# EAGLE design adc-iq-2185-xp2 (EAGLE 5.11)

## Sheet 1 of 4
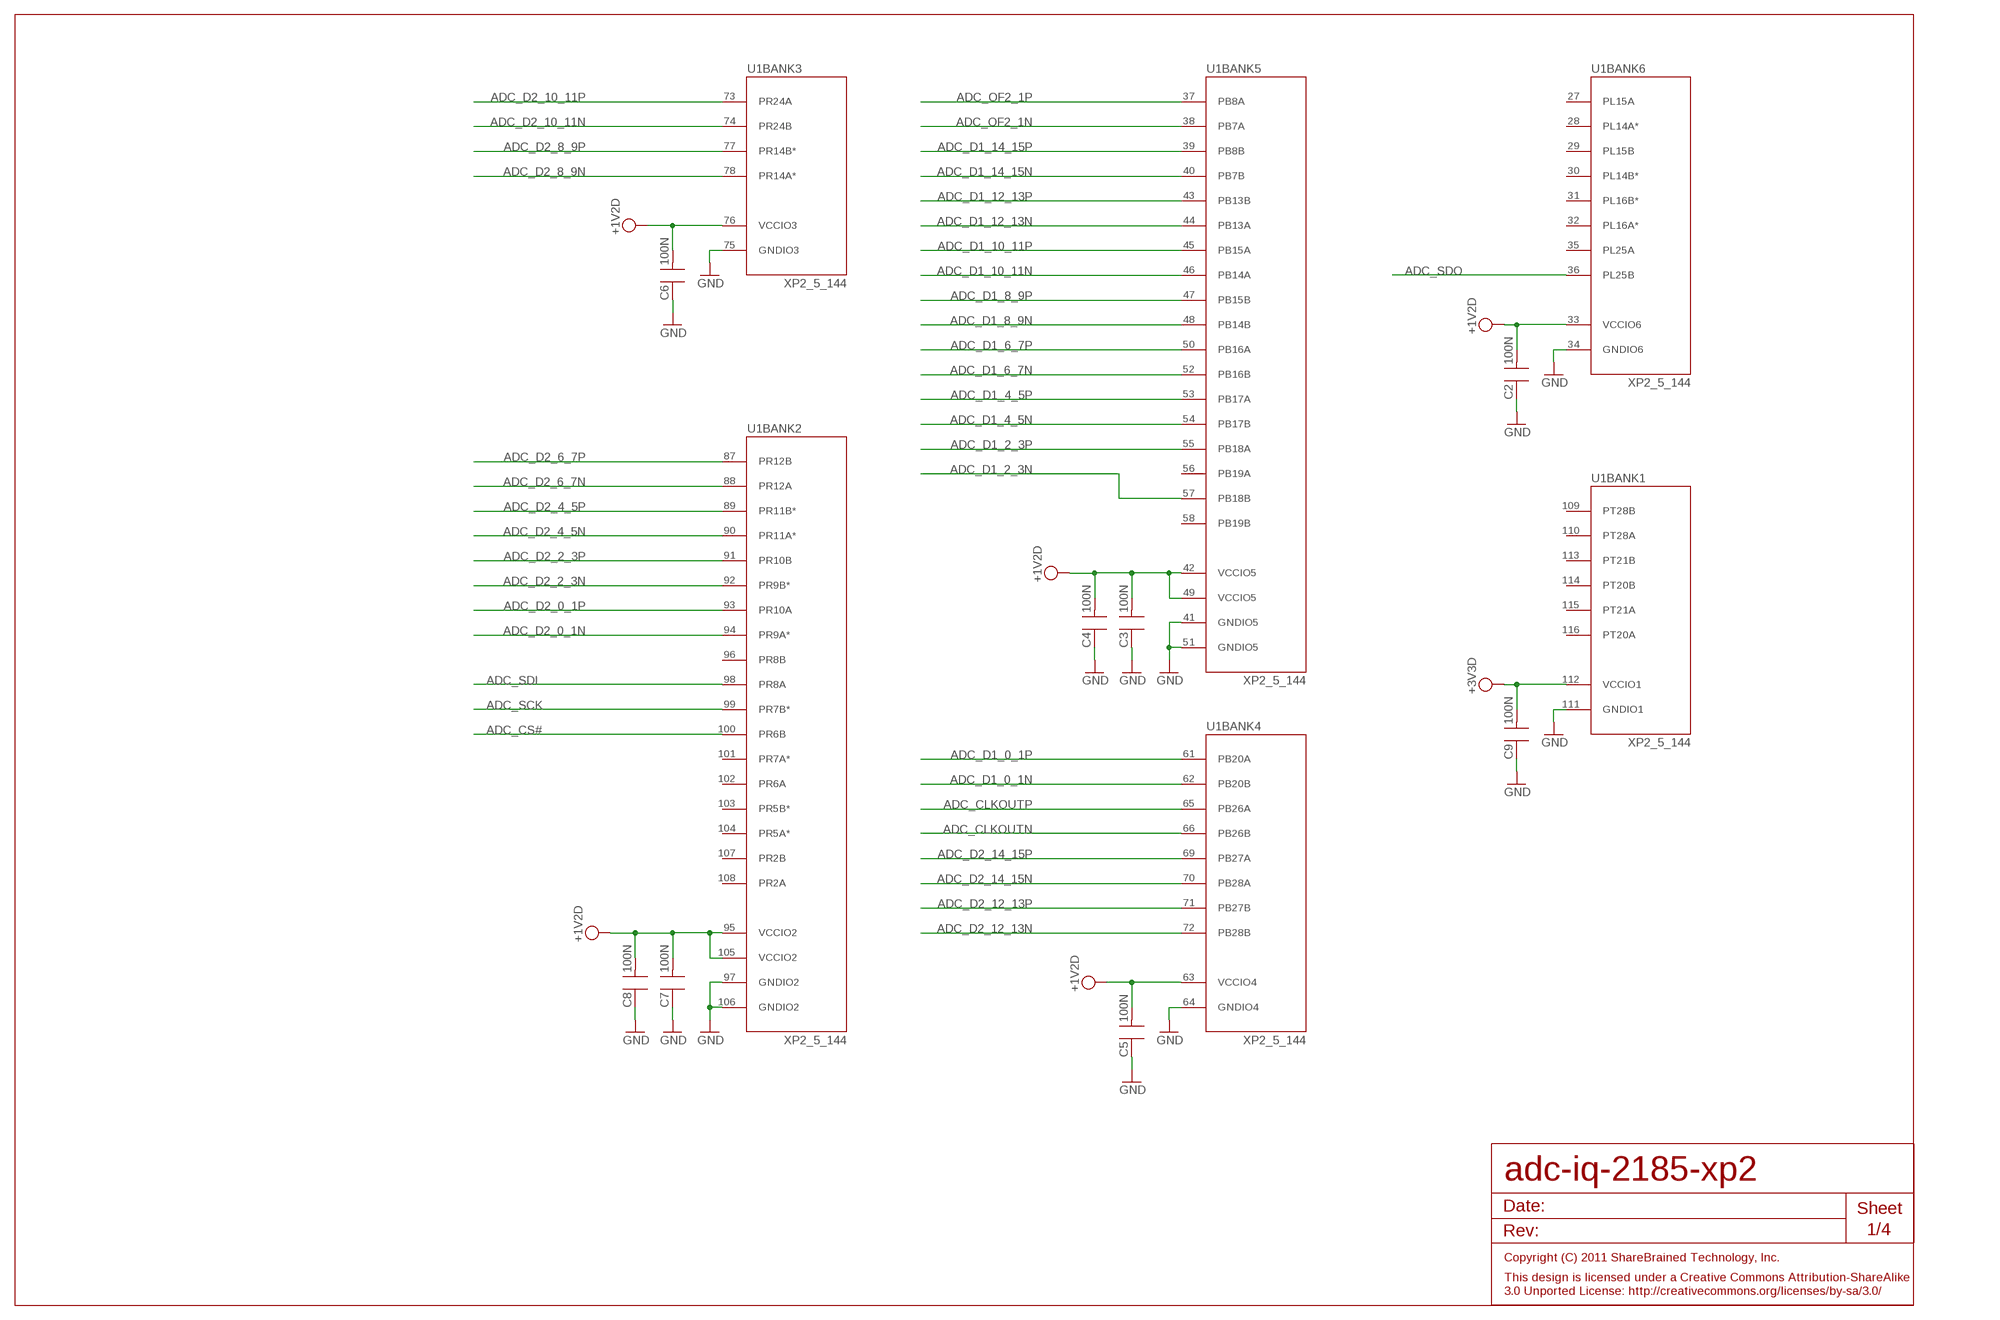
[diagram p0: schematic, sheet 1]

### Parts
C2  100N  C0402_55  [CAPC1005X55N]
C3  100N  C0402_55  [CAPC1005X55N]
C4  100N  C0402_55  [CAPC1005X55N]
C5  100N  C0402_55  [CAPC1005X55N]
C6  100N  C0402_55  [CAPC1005X55N]
C7  100N  C0402_55  [CAPC1005X55N]
C8  100N  C0402_55  [CAPC1005X55N]
C9  100N  C0402_55  [CAPC1005X55N]
U1  XP2_5_144  [QFP50P2200X2200X160-144N]

### Nets
+1V2D: C2.2 C3.2 C4.2 C5.2 C6.2 C7.2 C8.2 U1.33(BANK6:VCCIO6) U1.42(BANK5:VCCIO5) U1.49(BANK5:VCCIO5) U1.63(BANK4:VCCIO4) U1.76(BANK3:VCCIO3) U1.95(BANK2:VCCIO2) U1.105(BANK2:VCCIO2) ; also sheet 2,4
+3V3D: C9.2 U1.112(BANK1:VCCIO1) ; also sheet 2,3
ADC_CLKOUTN [lvds]: U1.66(BANK4:PB26B) ; also sheet 4
ADC_CLKOUTP [lvds]: U1.65(BANK4:PB26A) ; also sheet 4
ADC_CS#: U1.100(BANK2:PR6B) ; also sheet 4
ADC_D1_0_1N [lvds]: U1.62(BANK4:PB20B) ; also sheet 4
ADC_D1_0_1P [lvds]: U1.61(BANK4:PB20A) ; also sheet 4
ADC_D1_2_3N [lvds]: U1.57(BANK5:PB18B) ; also sheet 4
ADC_D1_2_3P [lvds]: U1.55(BANK5:PB18A) ; also sheet 4
ADC_D1_4_5N [lvds]: U1.54(BANK5:PB17B) ; also sheet 4
ADC_D1_4_5P [lvds]: U1.53(BANK5:PB17A) ; also sheet 4
ADC_D1_6_7N [lvds]: U1.52(BANK5:PB16B) ; also sheet 4
ADC_D1_6_7P [lvds]: U1.50(BANK5:PB16A) ; also sheet 4
ADC_D1_8_9N [lvds]: U1.48(BANK5:PB14B) ; also sheet 4
ADC_D1_8_9P [lvds]: U1.47(BANK5:PB15B) ; also sheet 4
ADC_D1_10_11N [lvds]: U1.46(BANK5:PB14A) ; also sheet 4
ADC_D1_10_11P [lvds]: U1.45(BANK5:PB15A) ; also sheet 4
ADC_D1_12_13N [lvds]: U1.44(BANK5:PB13A) ; also sheet 4
ADC_D1_12_13P [lvds]: U1.43(BANK5:PB13B) ; also sheet 4
ADC_D1_14_15N [lvds]: U1.40(BANK5:PB7B) ; also sheet 4
ADC_D1_14_15P [lvds]: U1.39(BANK5:PB8B) ; also sheet 4
ADC_D2_0_1N [lvds]: U1.94(BANK2:PR9A*) ; also sheet 4
ADC_D2_0_1P [lvds]: U1.93(BANK2:PR10A) ; also sheet 4
ADC_D2_2_3N [lvds]: U1.92(BANK2:PR9B*) ; also sheet 4
ADC_D2_2_3P [lvds]: U1.91(BANK2:PR10B) ; also sheet 4
ADC_D2_4_5N [lvds]: U1.90(BANK2:PR11A*) ; also sheet 4
ADC_D2_4_5P [lvds]: U1.89(BANK2:PR11B*) ; also sheet 4
ADC_D2_6_7N [lvds]: U1.88(BANK2:PR12A) ; also sheet 4
ADC_D2_6_7P [lvds]: U1.87(BANK2:PR12B) ; also sheet 4
ADC_D2_8_9N [lvds]: U1.78(BANK3:PR14A*) ; also sheet 4
ADC_D2_8_9P [lvds]: U1.77(BANK3:PR14B*) ; also sheet 4
ADC_D2_10_11N [lvds]: U1.74(BANK3:PR24B) ; also sheet 4
ADC_D2_10_11P [lvds]: U1.73(BANK3:PR24A) ; also sheet 4
ADC_D2_12_13N [lvds]: U1.72(BANK4:PB28B) ; also sheet 4
ADC_D2_12_13P [lvds]: U1.71(BANK4:PB27B) ; also sheet 4
ADC_D2_14_15N [lvds]: U1.70(BANK4:PB28A) ; also sheet 4
ADC_D2_14_15P [lvds]: U1.69(BANK4:PB27A) ; also sheet 4
ADC_OF2_1N [lvds]: U1.38(BANK5:PB7A) ; also sheet 4
ADC_OF2_1P [lvds]: U1.37(BANK5:PB8A) ; also sheet 4
ADC_SCK: U1.99(BANK2:PR7B*) ; also sheet 4
ADC_SDI: U1.98(BANK2:PR8A) ; also sheet 4
ADC_SDO: U1.36(BANK6:PL25B) ; also sheet 4
GND: C2.1 C3.1 C4.1 C5.1 C6.1 C7.1 C8.1 C9.1 U1.34(BANK6:GNDIO6) U1.41(BANK5:GNDIO5) U1.51(BANK5:GNDIO5) U1.64(BANK4:GNDIO4) U1.75(BANK3:GNDIO3) U1.97(BANK2:GNDIO2) U1.106(BANK2:GNDIO2) U1.111(BANK1:GNDIO1) ; also sheet 2,3,4
Unconnected: U1.27(BANK6:PL15A) U1.28(BANK6:PL14A*) U1.29(BANK6:PL15B) U1.30(BANK6:PL14B*) U1.31(BANK6:PL16B*) U1.32(BANK6:PL16A*) U1.35(BANK6:PL25A) U1.56(BANK5:PB19A) U1.58(BANK5:PB19B) U1.96(BANK2:PR8B) U1.101(BANK2:PR7A*) U1.102(BANK2:PR6A) U1.103(BANK2:PR5B*) U1.104(BANK2:PR5A*) U1.107(BANK2:PR2B) U1.108(BANK2:PR2A) U1.109(BANK1:PT28B) U1.110(BANK1:PT28A) U1.113(BANK1:PT21B) U1.114(BANK1:PT20B) U1.115(BANK1:PT21A) U1.116(BANK1:PT20A)

## Sheet 2 of 4
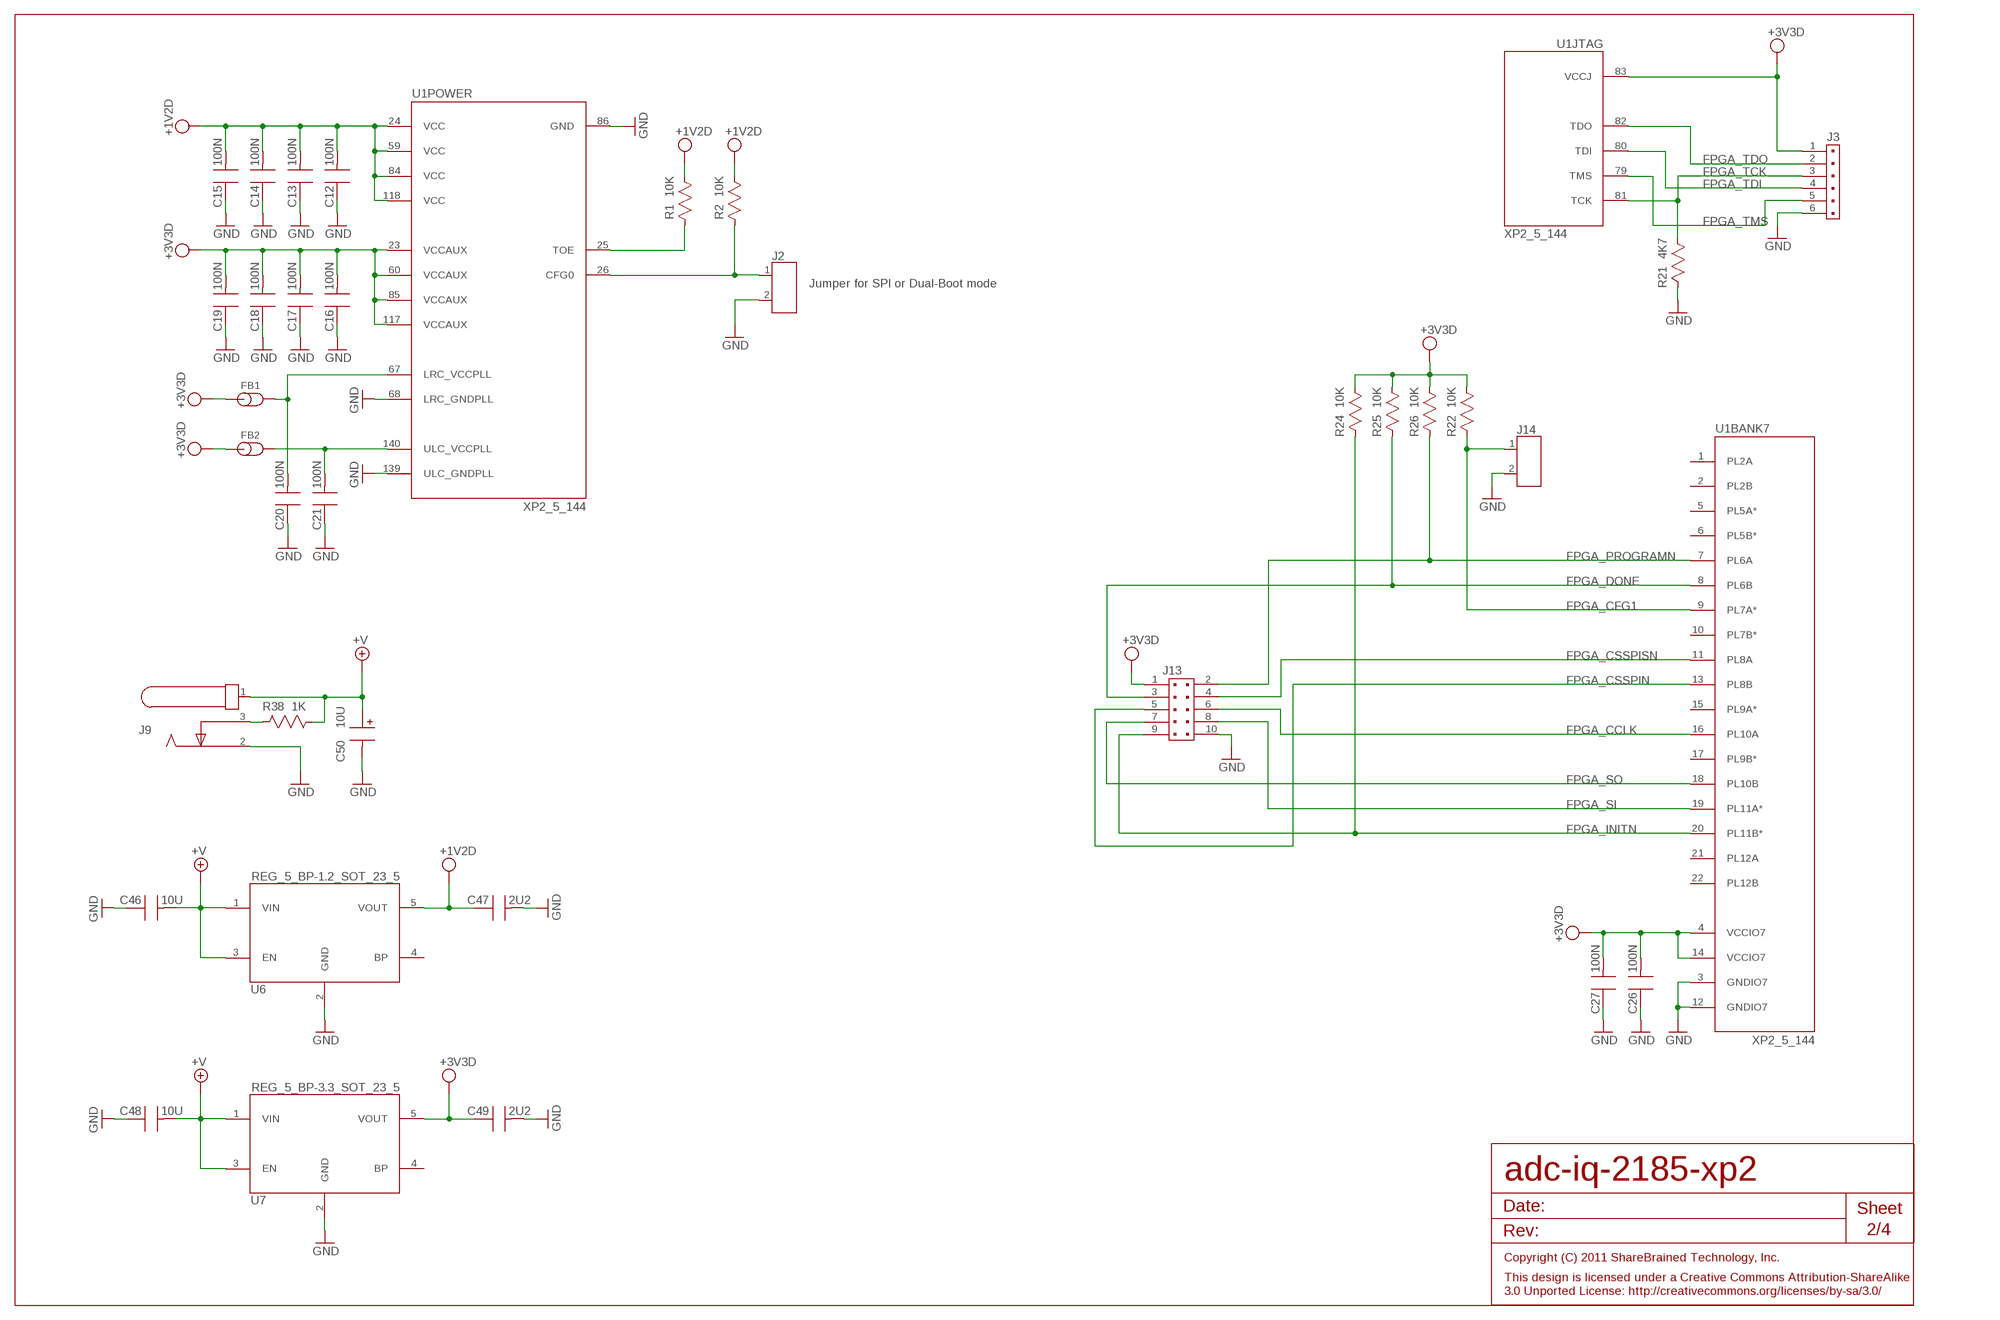
[diagram p1: schematic, sheet 2]

### Parts
C12  100N  C0402_55  [CAPC1005X55N]
C13  100N  C0402_55  [CAPC1005X55N]
C14  100N  C0402_55  [CAPC1005X55N]
C15  100N  C0402_55  [CAPC1005X55N]
C16  100N  C0402_55  [CAPC1005X55N]
C17  100N  C0402_55  [CAPC1005X55N]
C18  100N  C0402_55  [CAPC1005X55N]
C19  100N  C0402_55  [CAPC1005X55N]
C20  100N  C0402_55  [CAPC1005X55N]
C21  100N  C0402_55  [CAPC1005X55N]
C26  100N  C0402_55  [CAPC1005X55N]
C27  100N  C0402_55  [CAPC1005X55N]
C46  10U  C0805_135  [CAPC2012X135N]
C47  2U2  C0603_90  [CAPC1608X90N]
C48  10U  C0805_135  [CAPC2012X135N]
C49  2U2  C0603_90  [CAPC1608X90N]
C50  10U  CPOL7343-43  [CAPMP7343X430N]
FB1  FB0603  [INDC1608X95N]
FB2  FB0603  [INDC1608X95N]
J2  CON2TH-254  [HEADER254P1X2]
J3  HEADER1X6TH-254  [HEADER254P1X6]
J9  DC_3_CUI_PJ102A  [CUI_PJ_102A]
J13  HEADER2X5TH-254  [HEADER254P2X5]
J14  CON2TH-254  [HEADER254P1X2]
R1  10K  R0402_40  [RESC1005X40N]
R2  10K  R0402_40  [RESC1005X40N]
R21  4K7  R0402_40  [RESC1005X40N]
R22  10K  R0402_40  [RESC1005X40N]
R24  10K  R0402_40  [RESC1005X40N]
R25  10K  R0402_40  [RESC1005X40N]
R26  10K  R0402_40  [RESC1005X40N]
R38  1K  R0402_40  [RESC1005X40N]
U6  REG_5_BP-1.2_SOT_23_5  [SOT95P280X110-5N]
U7  REG_5_BP-3.3_SOT_23_5  [SOT95P280X110-5N]

### Nets
+1V2D: C12.2 C13.2 C14.2 C15.2 C47.1 R1.2 R2.2 U1.24(POWER:VCC) U1.59(POWER:VCC) U1.84(POWER:VCC) U1.118(POWER:VCC) U6.5(VOUT) ; also sheet 1,4
+3V3D: C16.2 C17.2 C18.2 C19.2 C26.2 C27.2 C49.1 FB1.1 FB2.1 J3.1 J13.1 R22.2 R24.2 R25.2 R26.2 U1.4(BANK7:VCCIO7) U1.14(BANK7:VCCIO7) U1.23(POWER:VCCAUX) U1.60(POWER:VCCAUX) U1.83(JTAG:VCCJ) U1.85(POWER:VCCAUX) U1.117(POWER:VCCAUX) U7.5(VOUT) ; also sheet 1,3
+V: C46.2 C48.2 C50.1 J9.1 R38.2 U6.1(VIN) U6.3(EN) U7.1(VIN) U7.3(EN) ; also sheet 4
FPGA_CCLK: J13.6 U1.16(BANK7:PL10A)
FPGA_CFG1: J14.1 R22.1 U1.9(BANK7:PL7A*)
FPGA_CSSPIN: J13.5 U1.13(BANK7:PL8B)
FPGA_CSSPISN: J13.4 U1.11(BANK7:PL8A)
FPGA_DONE: J13.3 R25.1 U1.8(BANK7:PL6B)
FPGA_INITN: J13.9 R24.1 U1.20(BANK7:PL11B*)
FPGA_PROGRAMN: J13.2 R26.1 U1.7(BANK7:PL6A)
FPGA_SI: J13.8 U1.19(BANK7:PL11A*)
FPGA_SO: J13.7 U1.18(BANK7:PL10B)
FPGA_TCK: J3.3 R21.2 U1.81(JTAG:TCK)
FPGA_TDI: J3.4 U1.80(JTAG:TDI)
FPGA_TDO: J3.2 U1.82(JTAG:TDO)
FPGA_TMS: J3.5 U1.79(JTAG:TMS)
GND: C12.1 C13.1 C14.1 C15.1 C16.1 C17.1 C18.1 C19.1 C20.1 C21.1 C26.1 C27.1 C46.1 C47.2 C48.1 C49.2 C50.2 J2.2 J3.6 J9.2 J13.10 J14.2 R21.1 U1.3(BANK7:GNDIO7) U1.12(BANK7:GNDIO7) U1.68(POWER:LRC_GNDPLL) U1.86(POWER:GND) U1.139(POWER:ULC_GNDPLL) U6.2(GND) U7.2(GND) ; also sheet 1,3,4
N$1: J2.1 R2.1 U1.26(POWER:CFG0)
N$3: J9.3 R38.1
N$11: R1.1 U1.25(POWER:TOE)
N$12: C20.2 FB1.2 U1.67(POWER:LRC_VCCPLL)
N$13: C21.2 FB2.2 U1.140(POWER:ULC_VCCPLL)
Unconnected: U1.1(BANK7:PL2A) U1.2(BANK7:PL2B) U1.5(BANK7:PL5A*) U1.6(BANK7:PL5B*) U1.10(BANK7:PL7B*) U1.15(BANK7:PL9A*) U1.17(BANK7:PL9B*) U1.21(BANK7:PL12A) U1.22(BANK7:PL12B) U6.4(BP) U7.4(BP)

### Notes on the sheet
- Jumper for SPI or Dual-Boot mode

## Sheet 3 of 4
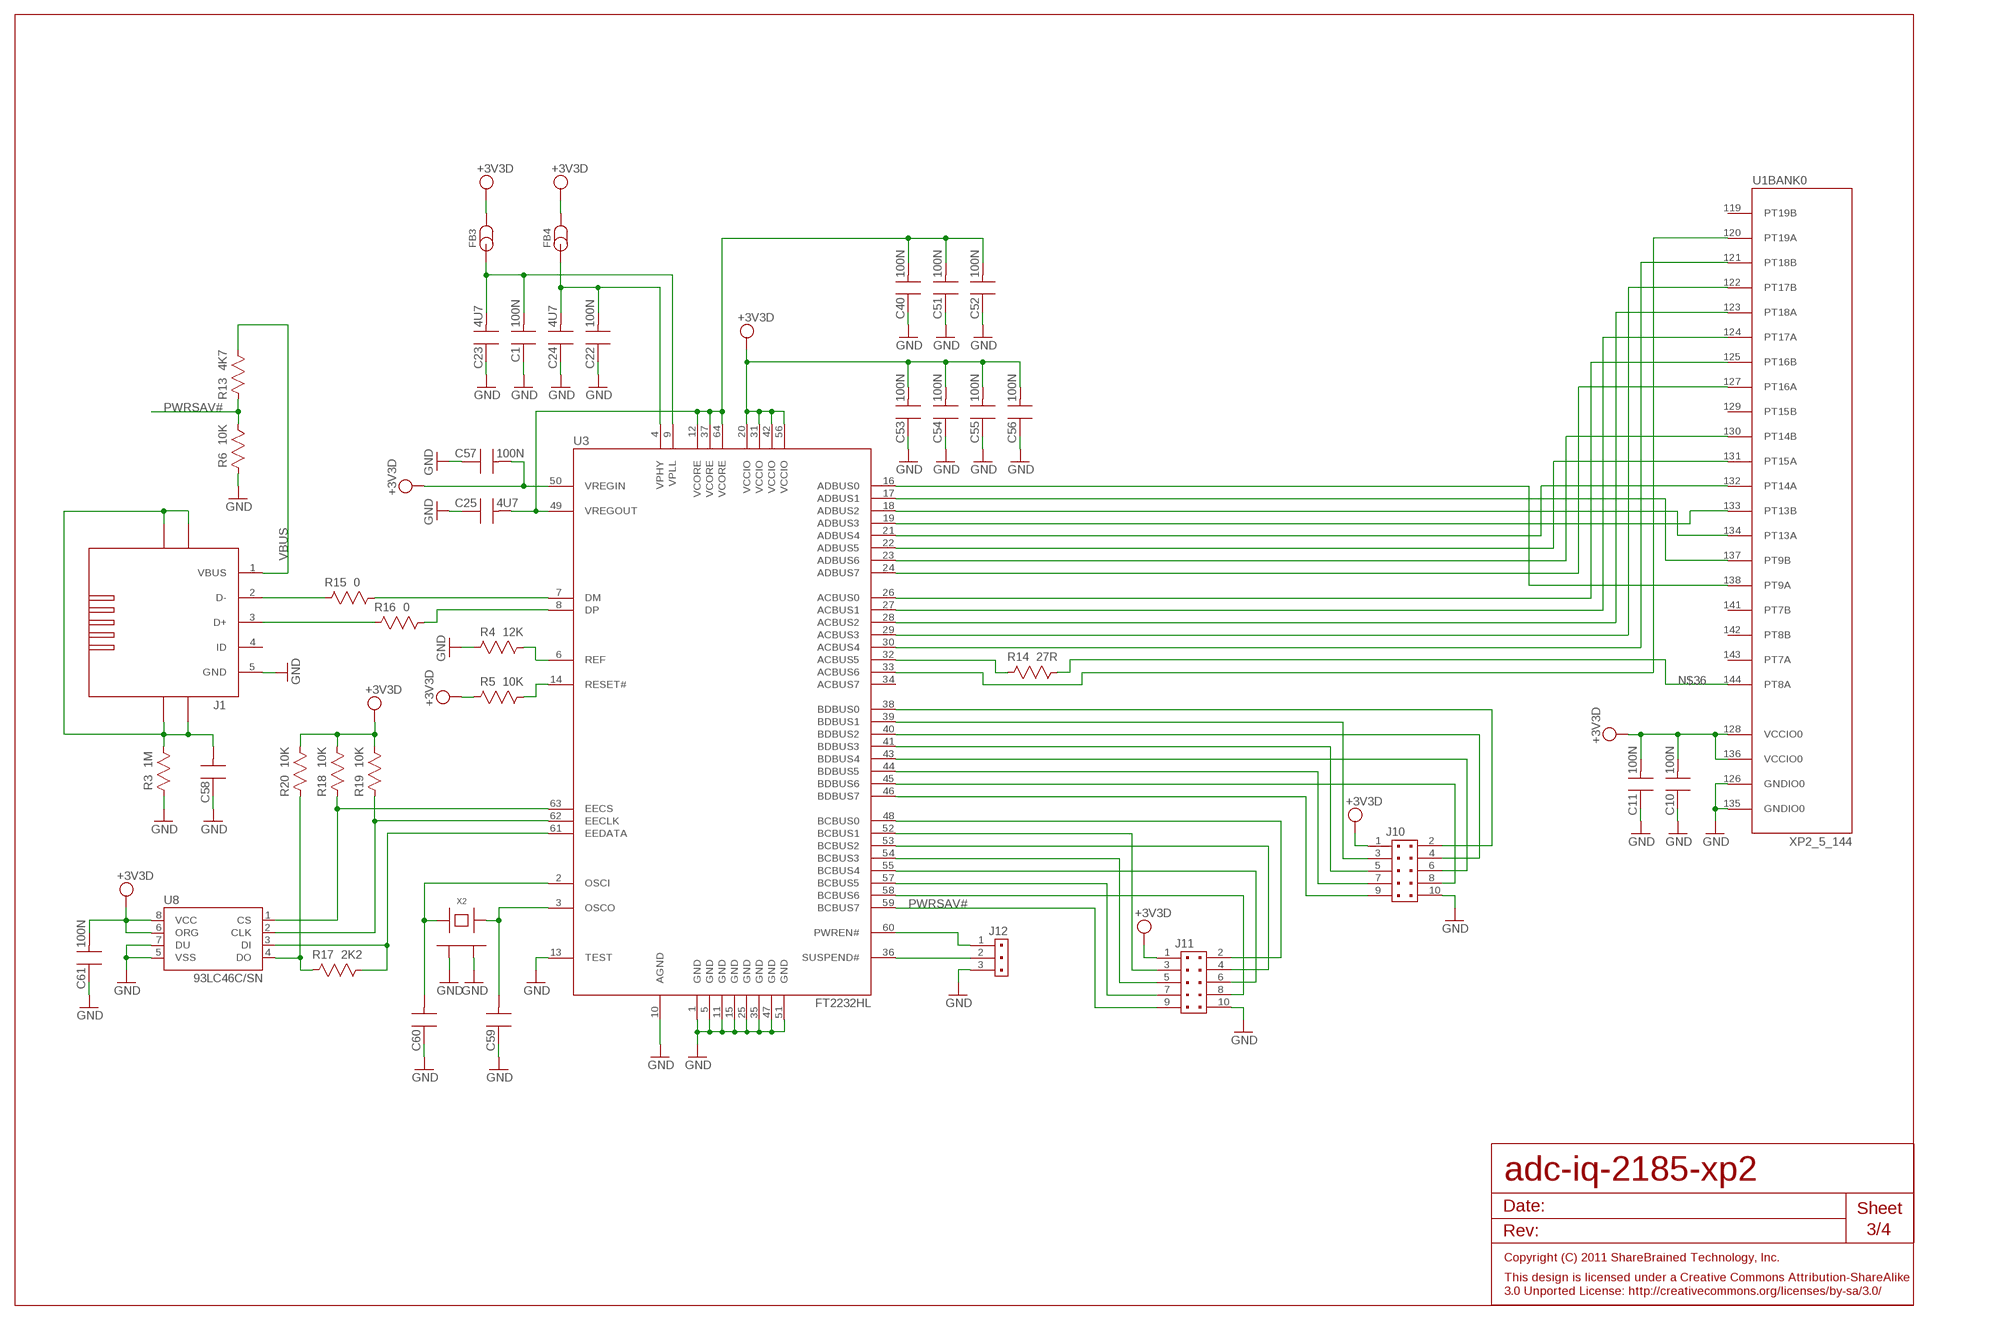
[diagram p2: schematic, sheet 3]

### Parts
C1  100N  C0402_55  [CAPC1005X55N]
C10  100N  C0402_55  [CAPC1005X55N]
C11  100N  C0402_55  [CAPC1005X55N]
C22  100N  C0402_55  [CAPC1005X55N]
C23  4U7  C0603_90  [CAPC1608X90N]
C24  4U7  C0603_90  [CAPC1608X90N]
C25  4U7  C0603_90  [CAPC1608X90N]
C40  100N  C0402_55  [CAPC1005X55N]
C51  100N  C0402_55  [CAPC1005X55N]
C52  100N  C0402_55  [CAPC1005X55N]
C53  100N  C0402_55  [CAPC1005X55N]
C54  100N  C0402_55  [CAPC1005X55N]
C55  100N  C0402_55  [CAPC1005X55N]
C56  100N  C0402_55  [CAPC1005X55N]
C57  100N  C0402_55  [CAPC1005X55N]
C58  C0402_55  [CAPC1005X55N]
C59  C0402_55  [CAPC1005X55N]
C60  C0402_55  [CAPC1005X55N]
C61  100N  C0402_55  [CAPC1005X55N]
FB3  FB0603  [INDC1608X95N]
FB4  FB0603  [INDC1608X95N]
J1  USB_MINI_B_HIROSE_UX60_MB_5ST  [HIROSE_UX60_MB_5ST]
J10  HEADER2X5TH-254  [HEADER254P2X5]
J11  HEADER2X5TH-254  [HEADER254P2X5]
J12  HEADER1X3TH-254  [HEADER254P1X3]
R3  1M  R0402_40  [RESC1005X40N]
R4  12K  R0402_40  [RESC1005X40N]
R5  10K  R0402_40  [RESC1005X40N]
R6  10K  R0402_40  [RESC1005X40N]
R13  4K7  R0402_40  [RESC1005X40N]
R14  27R  R0402_40  [RESC1005X40N]
R15  0  R0402_40  [RESC1005X40N]
R16  0  R0402_40  [RESC1005X40N]
R17  2K2  R0402_40  [RESC1005X40N]
R18  10K  R0402_40  [RESC1005X40N]
R19  10K  R0402_40  [RESC1005X40N]
R20  10K  R0402_40  [RESC1005X40N]
U3  FT2232HL  [QFP50P1200X1200X160-64N]
U8  93LC46C/SN  [SOIC127P600X175-8M]
X2  X_CASE2_NDK_NX3225SA  [OSCCC250X320X70-4N]

### Nets
+3V3D: C10.2 C11.2 C53.2 C54.2 C55.2 C56.2 C57.2 C61.2 FB3.2 FB4.2 J10.1 J11.1 R5.1 R18.2 R19.2 R20.2 U1.128(BANK0:VCCIO0) U1.136(BANK0:VCCIO0) U3.20(VCCIO) U3.31(VCCIO) U3.42(VCCIO) U3.50(VREGIN) U3.56(VCCIO) U8.6(ORG) U8.8(VCC) ; also sheet 1,2
FTDI_A_CLKOUT: R14.1 U3.32(ACBUS5)
FTDI_VCORE: C25.2 C40.2 C51.2 C52.2 U3.12(VCORE) U3.37(VCORE) U3.49(VREGOUT) U3.64(VCORE)
GND: C1.1 C10.1 C11.1 C22.1 C23.1 C24.1 C25.1 C40.1 C51.1 C52.1 C53.1 C54.1 C55.1 C56.1 C57.1 C58.1 C59.1 C60.1 C61.1 J1.5(GND) J10.10 J11.10 J12.3 R3.1 R4.1 R6.1 U1.126(BANK0:GNDIO0) U1.135(BANK0:GNDIO0) U3.1(GND) U3.5(GND) U3.10(AGND) U3.11(GND) U3.13(TEST) U3.15(GND) U3.25(GND) U3.35(GND) U3.47(GND) U3.51(GND) U8.5(VSS) U8.7(DU) X2.2(CASE) X2.4(CASE) ; also sheet 1,2,4
N$5: J10.2 U3.38(BDBUS0)
N$6: U1.138(BANK0:PT9A) U3.16(ADBUS0)
N$7: U1.137(BANK0:PT9B) U3.17(ADBUS1)
N$8: U1.134(BANK0:PT13A) U3.18(ADBUS2)
N$9: U1.133(BANK0:PT13B) U3.19(ADBUS3)
N$10: U1.132(BANK0:PT14A) U3.21(ADBUS4)
N$14: U1.131(BANK0:PT15A) U3.22(ADBUS5)
N$15: U1.130(BANK0:PT14B) U3.23(ADBUS6)
N$16: U1.127(BANK0:PT16A) U3.24(ADBUS7)
N$17: U1.125(BANK0:PT16B) U3.26(ACBUS0)
N$18: U1.124(BANK0:PT17A) U3.27(ACBUS1)
N$19: U1.123(BANK0:PT18A) U3.28(ACBUS2)
N$20: U1.122(BANK0:PT17B) U3.29(ACBUS3)
N$23: U1.121(BANK0:PT18B) U3.30(ACBUS4)
N$25: U1.120(BANK0:PT19A) U3.33(ACBUS6)
N$26: R15.2 U3.7(DM)
N$27: C22.2 C24.2 FB4.1 U3.4(VPHY)
N$28: C1.2 C23.2 FB3.1 U3.9(VPLL)
N$29: J1.3(D+) R16.1
N$30: C58.2 J1.SHIELD@1(SHIELD) J1.SHIELD@2(SHIELD) J1.SHIELD@3(SHIELD) J1.SHIELD@4(SHIELD) R3.2
N$31: C59.2 U3.3(OSCO) X2.3
N$32: C60.2 U3.2(OSCI) X2.1
N$33: R4.2 U3.6(REF)
N$34: R5.2 U3.14(RESET#)
N$35: J10.3 U3.39(BDBUS1)
N$36: R14.2 U1.144(BANK0:PT8A)
N$37: J1.2(D-) R15.1
N$38: R16.2 U3.8(DP)
N$39: R18.1 U3.63(EECS) U8.1(CS)
N$40: R19.1 U3.62(EECLK) U8.2(CLK)
N$41: R17.2 U3.61(EEDATA) U8.3(DI)
N$42: R17.1 R20.1 U8.4(DO)
N$43: J10.4 U3.40(BDBUS2)
N$44: J10.5 U3.41(BDBUS3)
N$45: J10.6 U3.43(BDBUS4)
N$46: J10.7 U3.44(BDBUS5)
N$47: J10.8 U3.45(BDBUS6)
N$48: J10.9 U3.46(BDBUS7)
N$49: J11.2 U3.48(BCBUS0)
N$50: J11.3 U3.52(BCBUS1)
N$51: J11.4 U3.53(BCBUS2)
N$52: J11.5 U3.54(BCBUS3)
N$53: J11.6 U3.55(BCBUS4)
N$54: J11.7 U3.57(BCBUS5)
N$55: J11.8 U3.58(BCBUS6)
N$58: J12.1 U3.60(PWREN#)
N$59: J12.2 U3.36(SUSPEND#)
PWRSAV#: J11.9 R6.2 R13.1 U3.59(BCBUS7)
VBUS: J1.1(VBUS) R13.2
Unconnected: J1.4(ID) U1.119(BANK0:PT19B) U1.129(BANK0:PT15B) U1.141(BANK0:PT7B) U1.142(BANK0:PT8B) U1.143(BANK0:PT7A) U3.34(ACBUS7)

## Sheet 4 of 4
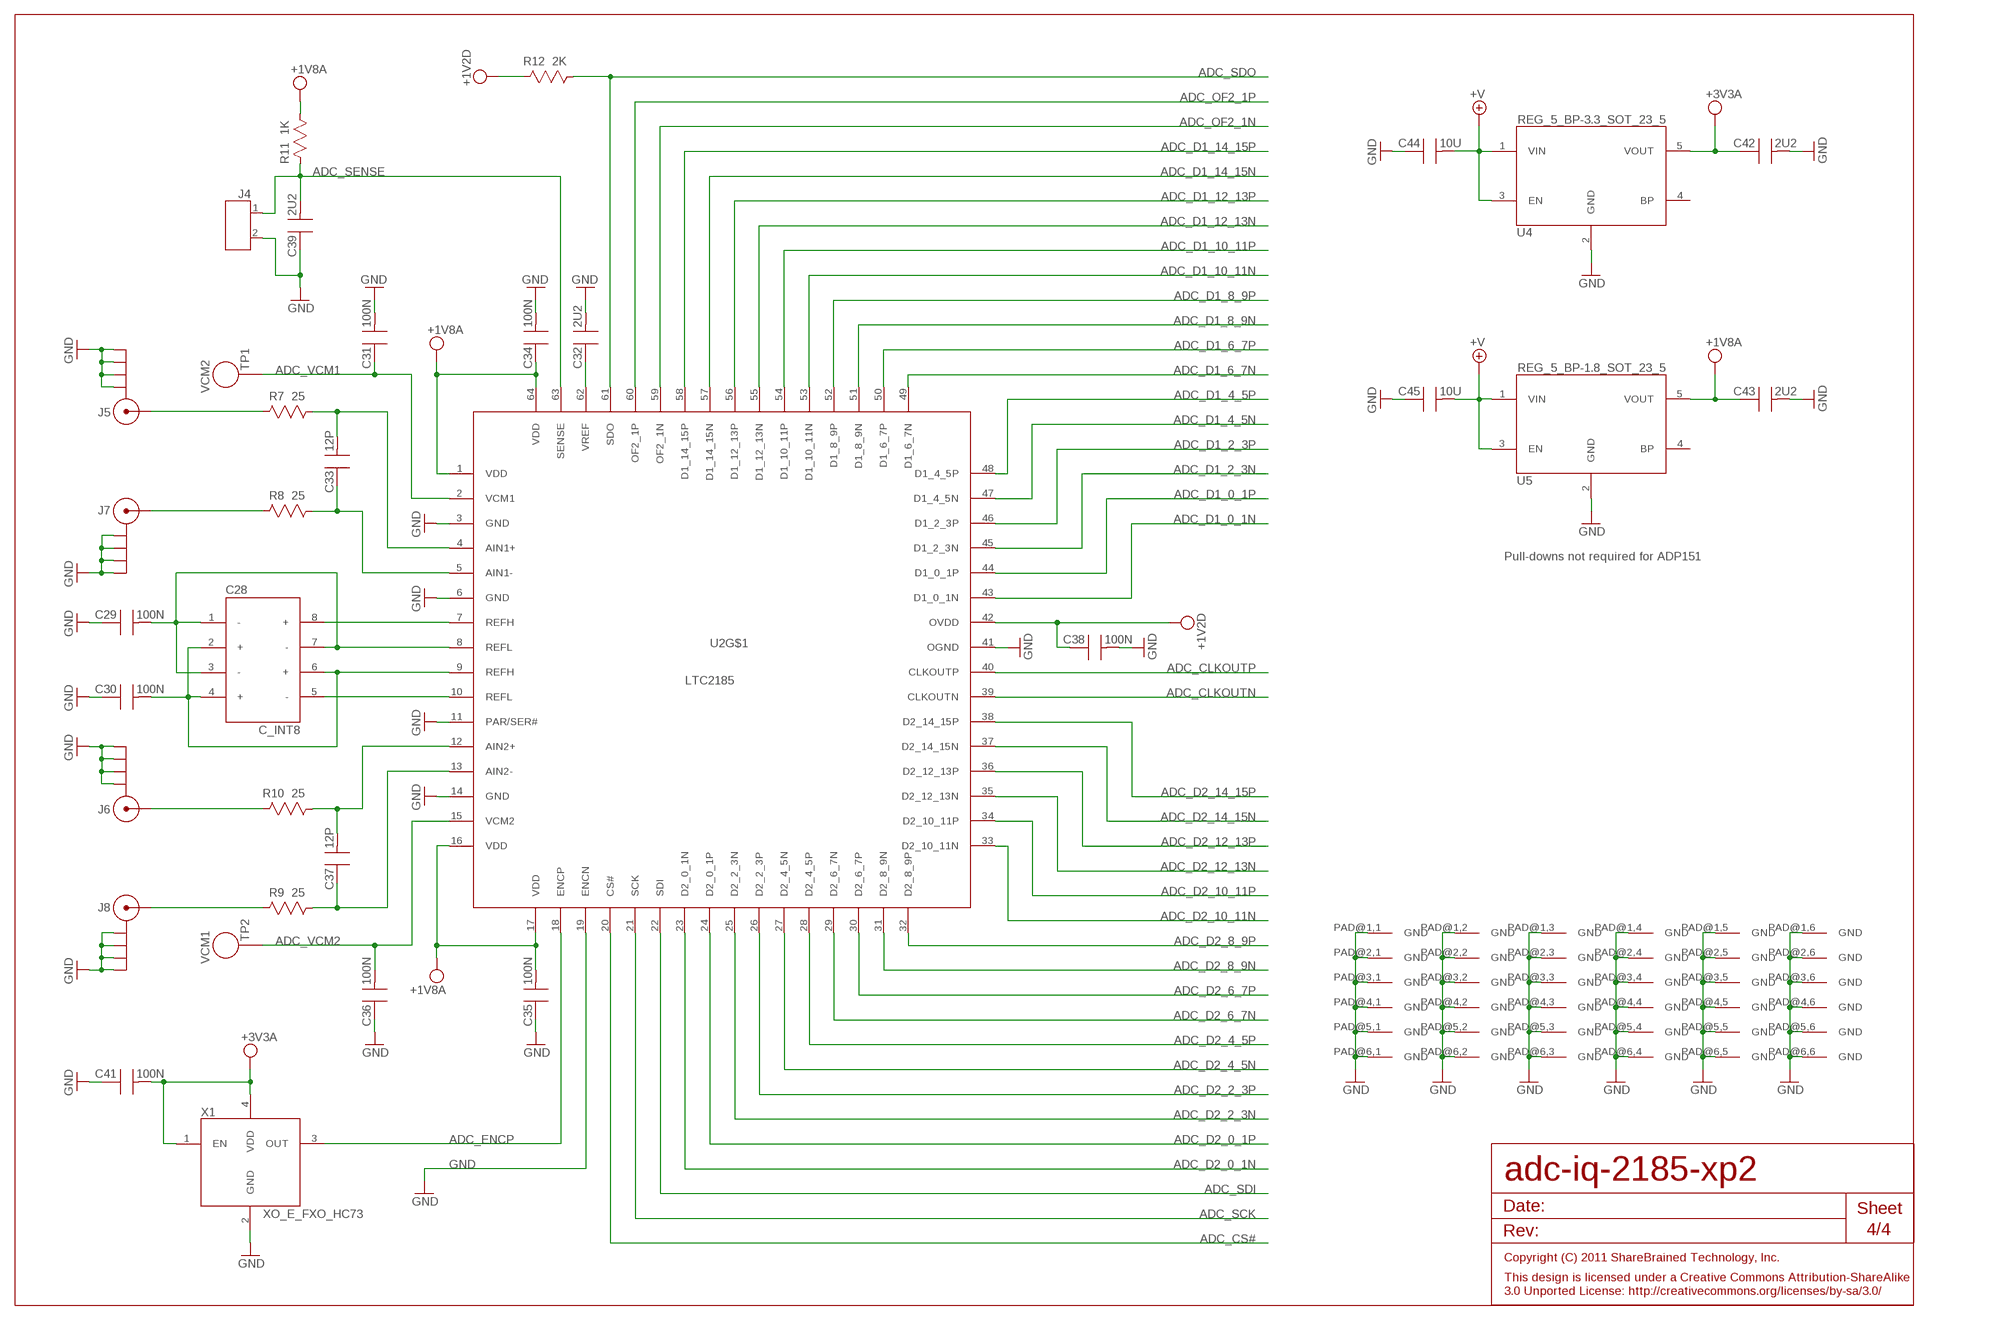
[diagram p3: schematic, sheet 4]

### Parts
C28  C_INT8  [AVX_W2L1]
C29  100N  C0402_55  [CAPC1005X55N]
C30  100N  C0402_55  [CAPC1005X55N]
C31  100N  C0402_55  [CAPC1005X55N]
C32  2U2  C0402_55  [CAPC1005X55N]
C33  12P  C0402_55  [CAPC1005X55N]
C34  100N  C0402_55  [CAPC1005X55N]
C35  100N  C0402_55  [CAPC1005X55N]
C36  100N  C0402_55  [CAPC1005X55N]
C37  12P  C0402_55  [CAPC1005X55N]
C38  100N  C0402_55  [CAPC1005X55N]
C39  2U2  C0402_55  [CAPC1005X55N]
C41  100N  C0402_55  [CAPC1005X55N]
C42  2U2  C0603_90  [CAPC1608X90N]
C43  2U2  C0603_90  [CAPC1608X90N]
C44  10U  C0805_135  [CAPC2012X135N]
C45  10U  C0805_135  [CAPC2012X135N]
J4  CON2TH-254  [HEADER254P1X2]
J5  SMA142-0701-801  [142-0701-801]
J6  SMA142-0701-801  [142-0701-801]
J7  SMA142-0701-801  [142-0701-801]
J8  SMA142-0701-801  [142-0701-801]
R7  25  R0402_40  [RESC1005X40N]
R8  25  R0402_40  [RESC1005X40N]
R9  25  R0402_40  [RESC1005X40N]
R10  25  R0402_40  [RESC1005X40N]
R11  1K  R0402_40  [RESC1005X40N]
R12  2K  R0402_40  [RESC1005X40N]
TP1  VCM2  TP_MILLMAX_TH239  [2501-2-00-80-00-00-07-0]
TP2  VCM1  TP_MILLMAX_TH239  [2501-2-00-80-00-00-07-0]
U2  LTC2185  [QFN50P900X900X80-65AN]
U4  REG_5_BP-3.3_SOT_23_5  [SOT95P280X110-5N]
U5  REG_5_BP-1.8_SOT_23_5  [SOT95P280X110-5N]
X1  XO_E_FXO_HC73  [FXO_HC73]

### Nets
+1V2D: C38.1 R12.1 U2.42(OVDD) ; also sheet 1,2
+1V8A: C34.1 C35.2 C43.1 R11.2 U2.1(VDD) U2.16(VDD) U2.17(VDD) U2.64(VDD) U5.5(VOUT)
+3V3A: C41.2 C42.1 U4.5(VOUT) X1.1(EN) X1.4(VDD)
+V: C44.2 C45.2 U4.1(VIN) U4.3(EN) U5.1(VIN) U5.3(EN) ; also sheet 2
ADC_AIN1+: C33.2 R7.2 U2.4(AIN1+)
ADC_AIN1-: C33.1 R8.2 U2.5(AIN1-)
ADC_AIN2+: C37.2 R10.2 U2.12(AIN2+)
ADC_AIN2-: C37.1 R9.2 U2.13(AIN2-)
ADC_CLKOUTN [lvds]: U2.39(CLKOUTN) ; also sheet 1
ADC_CLKOUTP [lvds]: U2.40(CLKOUTP) ; also sheet 1
ADC_CS#: U2.20(CS#) ; also sheet 1
ADC_D1_0_1N [lvds]: U2.43(D1_0_1N) ; also sheet 1
ADC_D1_0_1P [lvds]: U2.44(D1_0_1P) ; also sheet 1
ADC_D1_2_3N [lvds]: U2.45(D1_2_3N) ; also sheet 1
ADC_D1_2_3P [lvds]: U2.46(D1_2_3P) ; also sheet 1
ADC_D1_4_5N [lvds]: U2.47(D1_4_5N) ; also sheet 1
ADC_D1_4_5P [lvds]: U2.48(D1_4_5P) ; also sheet 1
ADC_D1_6_7N [lvds]: U2.49(D1_6_7N) ; also sheet 1
ADC_D1_6_7P [lvds]: U2.50(D1_6_7P) ; also sheet 1
ADC_D1_8_9N [lvds]: U2.51(D1_8_9N) ; also sheet 1
ADC_D1_8_9P [lvds]: U2.52(D1_8_9P) ; also sheet 1
ADC_D1_10_11N [lvds]: U2.53(D1_10_11N) ; also sheet 1
ADC_D1_10_11P [lvds]: U2.54(D1_10_11P) ; also sheet 1
ADC_D1_12_13N [lvds]: U2.55(D1_12_13N) ; also sheet 1
ADC_D1_12_13P [lvds]: U2.56(D1_12_13P) ; also sheet 1
ADC_D1_14_15N [lvds]: U2.57(D1_14_15N) ; also sheet 1
ADC_D1_14_15P [lvds]: U2.58(D1_14_15P) ; also sheet 1
ADC_D2_0_1N [lvds]: U2.23(D2_0_1N) ; also sheet 1
ADC_D2_0_1P [lvds]: U2.24(D2_0_1P) ; also sheet 1
ADC_D2_2_3N [lvds]: U2.25(D2_2_3N) ; also sheet 1
ADC_D2_2_3P [lvds]: U2.26(D2_2_3P) ; also sheet 1
ADC_D2_4_5N [lvds]: U2.27(D2_4_5N) ; also sheet 1
ADC_D2_4_5P [lvds]: U2.28(D2_4_5P) ; also sheet 1
ADC_D2_6_7N [lvds]: U2.29(D2_6_7N) ; also sheet 1
ADC_D2_6_7P [lvds]: U2.30(D2_6_7P) ; also sheet 1
ADC_D2_8_9N [lvds]: U2.31(D2_8_9N) ; also sheet 1
ADC_D2_8_9P [lvds]: U2.32(D2_8_9P) ; also sheet 1
ADC_D2_10_11N [lvds]: U2.33(D2_10_11N) ; also sheet 1
ADC_D2_10_11P [lvds]: U2.34(D2_10_11P) ; also sheet 1
ADC_D2_12_13N [lvds]: U2.35(D2_12_13N) ; also sheet 1
ADC_D2_12_13P [lvds]: U2.36(D2_12_13P) ; also sheet 1
ADC_D2_14_15N [lvds]: U2.37(D2_14_15N) ; also sheet 1
ADC_D2_14_15P [lvds]: U2.38(D2_14_15P) ; also sheet 1
ADC_ENCP: U2.18(ENCP) X1.3(OUT)
ADC_OF2_1N [lvds]: U2.59(OF2_1N) ; also sheet 1
ADC_OF2_1P [lvds]: U2.60(OF2_1P) ; also sheet 1
ADC_SCK: U2.21(SCK) ; also sheet 1
ADC_SDI: U2.22(SDI) ; also sheet 1
ADC_SDO: R12.2 U2.61(SDO) ; also sheet 1
ADC_SENSE: C39.2 J4.1 R11.1 U2.63(SENSE)
ADC_VCM1: C31.1 TP1.1 U2.2(VCM1)
ADC_VCM2: C36.2 TP2.1 U2.15(VCM2)
AIN1+ [50ohm]: J5.TIP R7.1
AIN1- [50ohm]: J7.TIP R8.1
AIN2+ [50ohm]: J6.TIP R10.1
AIN2- [50ohm]: J8.TIP R9.1
GND: C29.1 C30.1 C31.2 C32.2 C34.2 C35.1 C36.1 C38.2 C39.1 C41.1 C42.2 C43.2 C44.1 C45.1 J4.2 J5.RING@1(RING) J5.RING@2(RING) J5.RING@3(RING) J5.RING@4(RING) J6.RING@1(RING) J6.RING@2(RING) J6.RING@3(RING) J6.RING@4(RING) J7.RING@1(RING) J7.RING@2(RING) J7.RING@3(RING) J7.RING@4(RING) J8.RING@1(RING) J8.RING@2(RING) J8.RING@3(RING) J8.RING@4(RING) U2.3(GND) U2.6(GND) U2.11(PAR/SER#) U2.14(GND) U2.19(ENCN) U2.41(OGND) U2.PAD@1,1(GND) U2.PAD@1,2(GND) U2.PAD@1,3(GND) U2.PAD@1,4(GND) U2.PAD@1,5(GND) U2.PAD@1,6(GND) U2.PAD@2,1(GND) U2.PAD@2,2(GND) U2.PAD@2,3(GND) U2.PAD@2,4(GND) U2.PAD@2,5(GND) U2.PAD@2,6(GND) U2.PAD@3,1(GND) U2.PAD@3,2(GND) U2.PAD@3,3(GND) U2.PAD@3,4(GND) U2.PAD@3,5(GND) U2.PAD@3,6(GND) U2.PAD@4,1(GND) U2.PAD@4,2(GND) U2.PAD@4,3(GND) U2.PAD@4,4(GND) U2.PAD@4,5(GND) U2.PAD@4,6(GND) U2.PAD@5,1(GND) U2.PAD@5,2(GND) U2.PAD@5,3(GND) U2.PAD@5,4(GND) U2.PAD@5,5(GND) U2.PAD@5,6(GND) U2.PAD@6,1(GND) U2.PAD@6,2(GND) U2.PAD@6,3(GND) U2.PAD@6,4(GND) U2.PAD@6,5(GND) U2.PAD@6,6(GND) U4.2(GND) U5.2(GND) X1.2(GND) ; also sheet 1,2,3
N$2: C28.2(+) C28.4(+) C28.6(+) C30.2 U2.9(REFH)
N$4: C32.1 U2.62(VREF)
N$21: C28.8(+) U2.7(REFH)
N$22: C28.1(-) C28.3(-) C28.7(-) C29.2 U2.8(REFL)
N$24: C28.5(-) U2.10(REFL)
Unconnected: U4.4(BP) U5.4(BP)

### Notes on the sheet
- Pull-downs not required for ADP151

## Library data of the parts
C1-C27 C29-C49 C51-C61 = capacitor:C
C28 = capacitor:C_INT8
C50 = capacitor:CPOL
FB1-FB4 = inductor:FB
J1 = usb:USB_MINI_B
J2 J4 J14 = stake:CON2
J3 = stake:HEADER1X6
J5-J8 = sma:SMA
J9 = dc_connector:DC_3
J10 J11 J13 = stake:HEADER2X5
J12 = stake:HEADER1X3
R1-R22 R24-R26 R38 = resistor:R
TP1 TP2 = millmax:TP
U1 = lattice:XP2_5_144
U2 = ltc:LTC2185
U3 = ftdi:FT2232H
U4-U7 = regulator:REG_5_BP-*
U8 = eeprom:93*46C/?
X1 = oscillator:XO_E
X2 = crystal:X_CASE2

## Net classes
1 50ohm: width 0.3 mm, clearance 0.6 mm
2 lvds: width 0.3 mm, clearance 0.2 mm

## Board
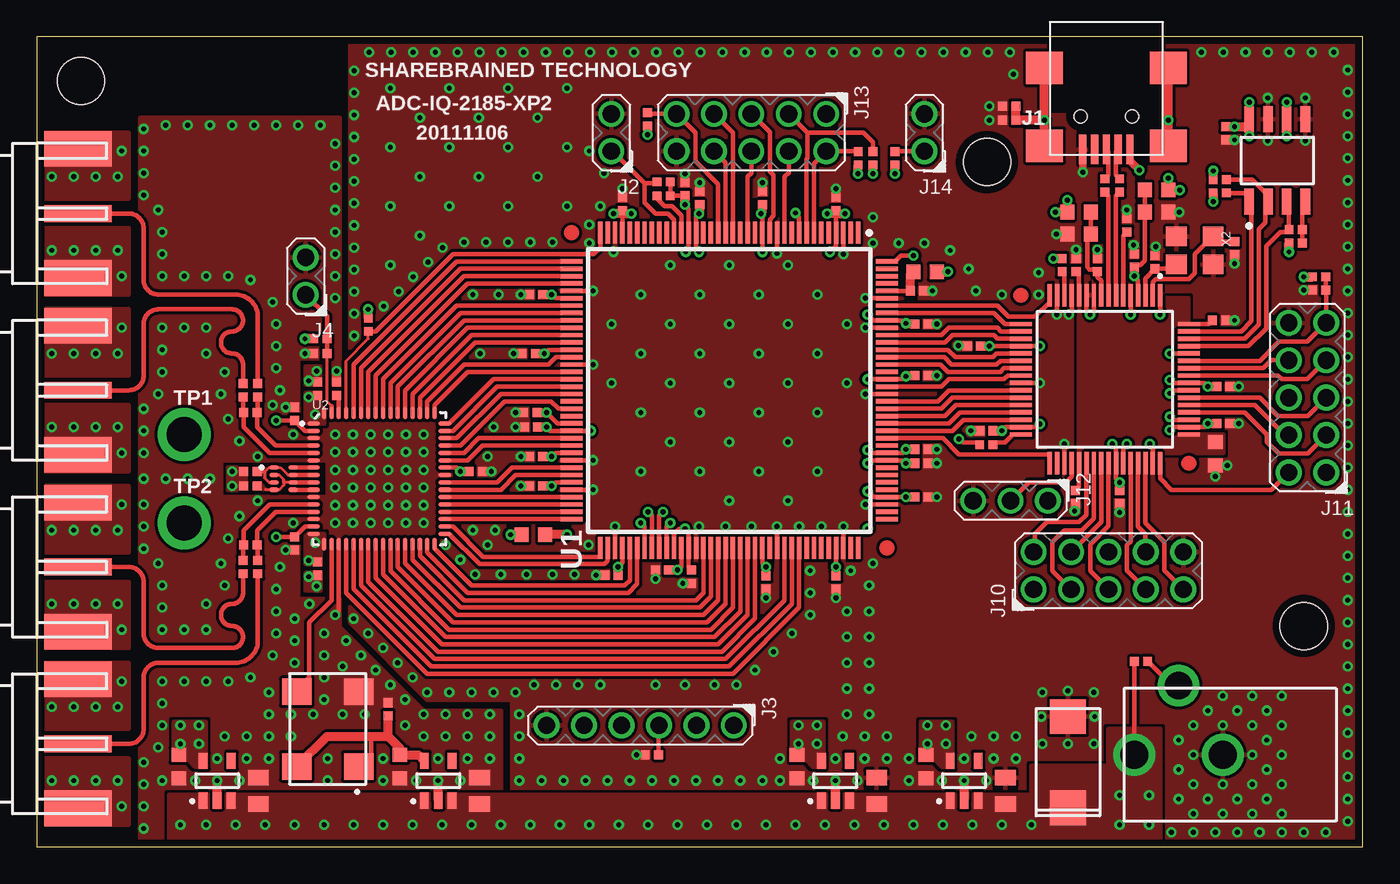
[diagram p4: board, top side]
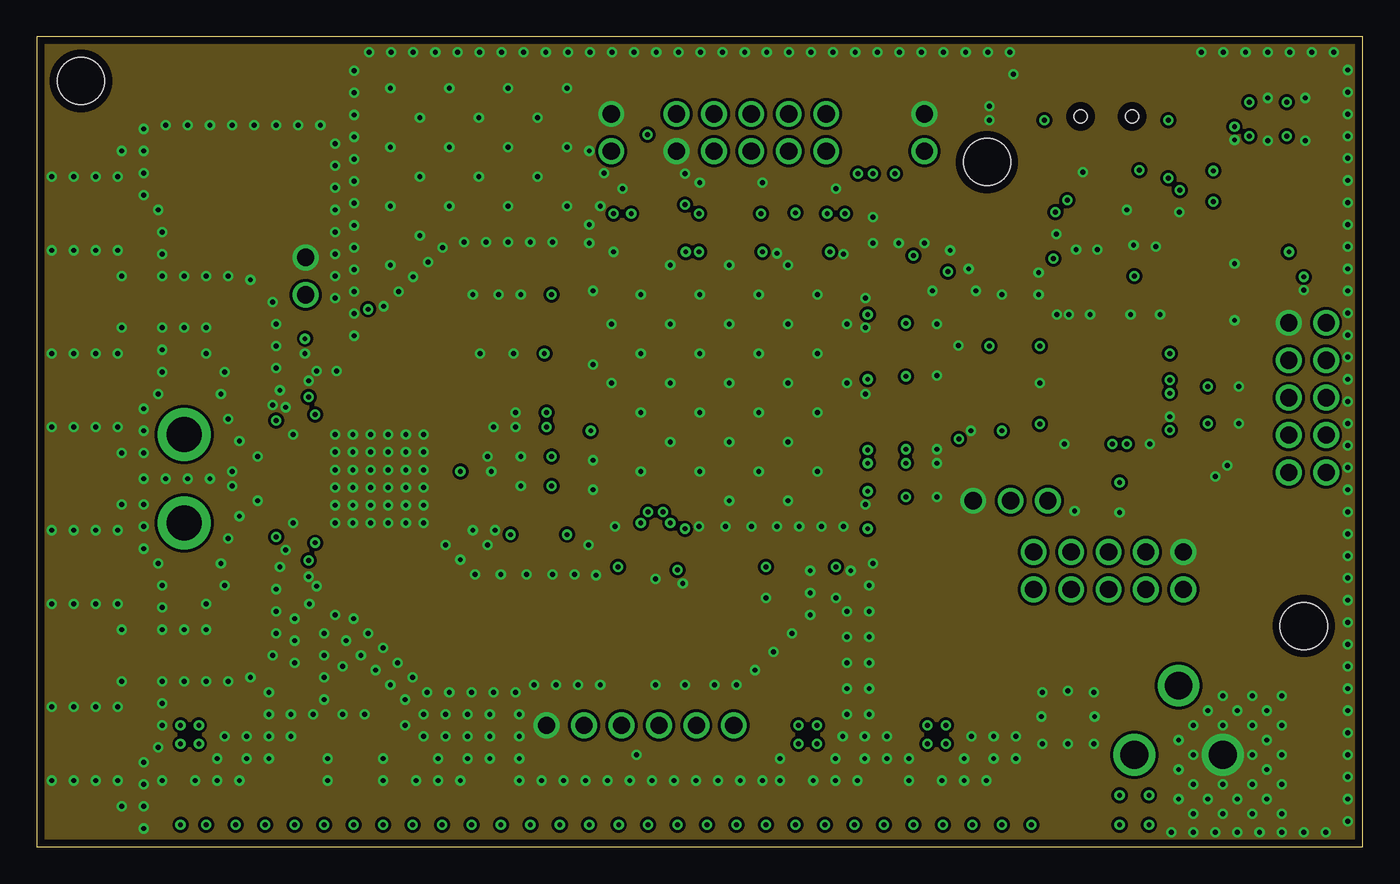
[diagram p5: board, inner layer Route2]
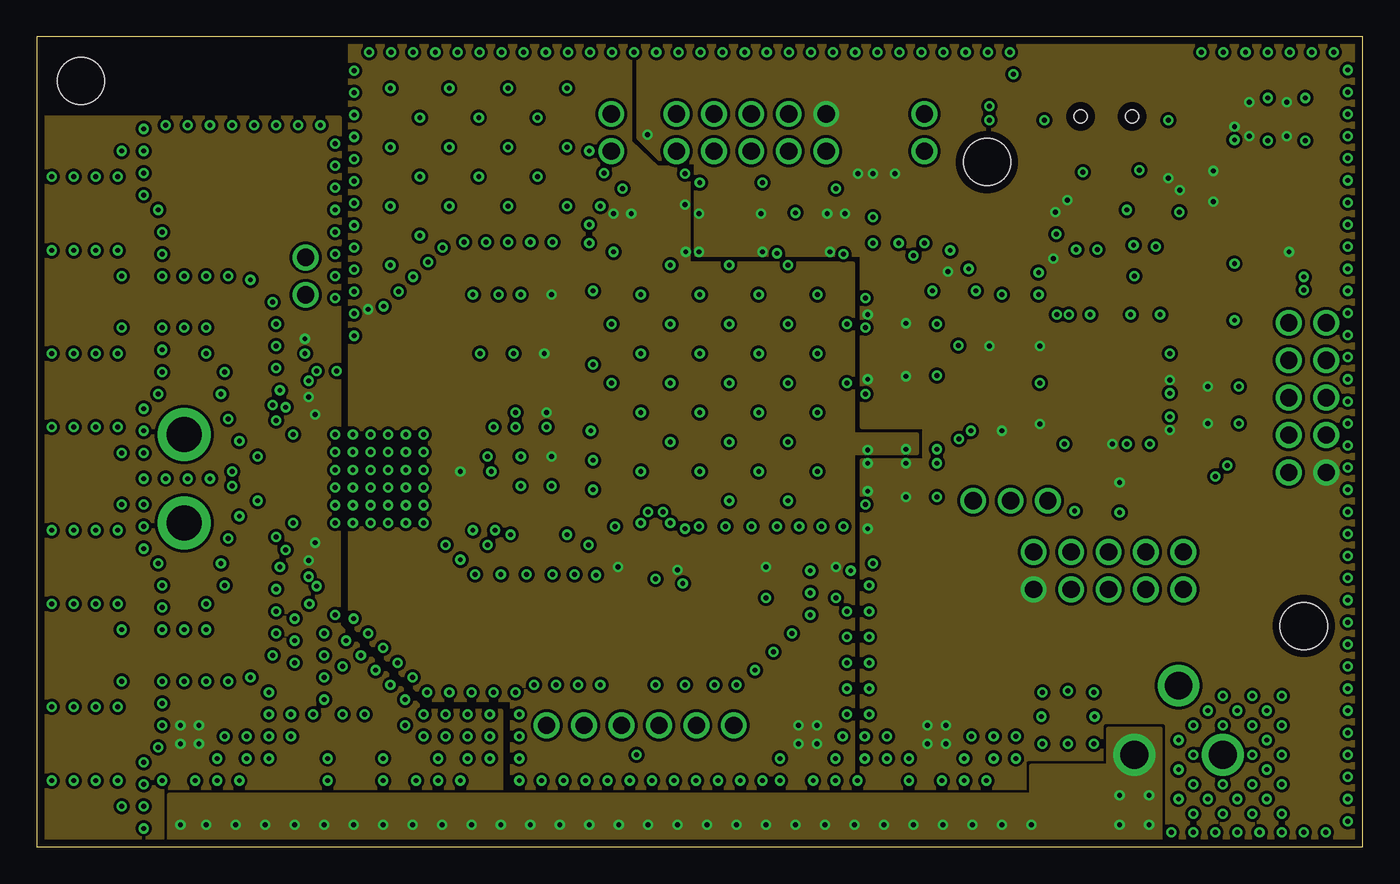
[diagram p6: board, inner layer Route15]
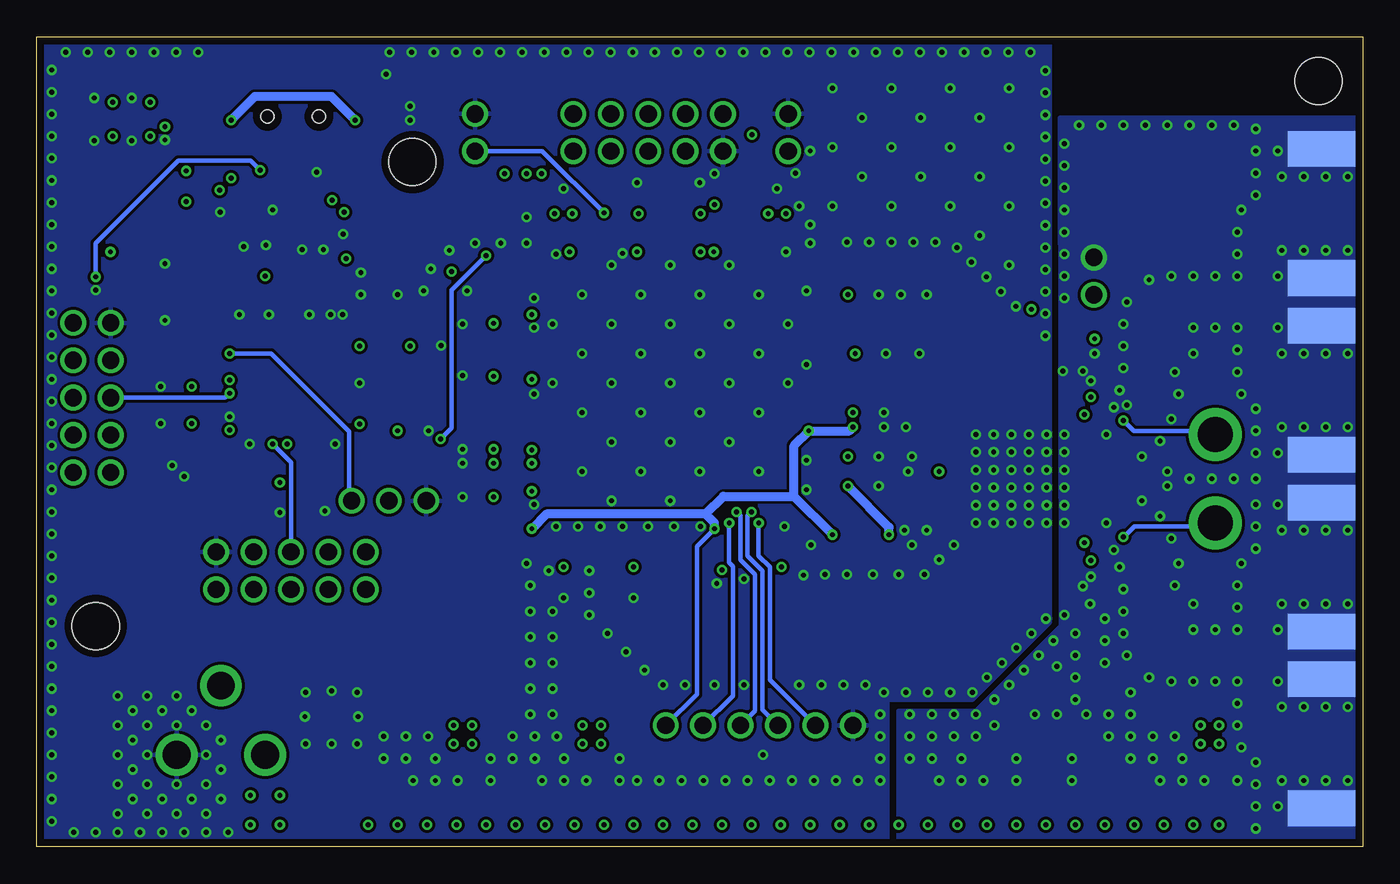
[diagram p7: board, bottom side, seen from below]

Size 90 x 55 mm. Coordinates in mm from the lower left corner, seen from the top.
Outline: 0,0 90,0 90,55 0,55 0,0
Copper layers (1+2*15+16): Top 0.0356mm / dielectric 0.1981mm / Route2 0.0178mm / dielectric 0.99mm / Route15 0.0178mm / dielectric 0.1981mm / Bottom 0.0356mm
Design rules "laen-four-min *": minimum track width 0.15mm, minimum drill 13mil, track to track 0.2mm, track to pad 0.2mm, pad to pad 0.2mm, via to via 0.2mm, smd to smd 0.2mm, copper to edge 20mil, drill to drill 16mil, minimum pad ring 7mil, minimum via ring 7mil, stop-mask expansion 3mil, vias tented up to drill 13mil, thermal gap 8mil
Holes 3.2 mm at 3,52 86,15 64.5,46.5

### Footprints (pad centres in the part's own frame; a part is rotated, then mirrored left to right if it is on the bottom)
CAPC1005X55N = smd 0.62 x 0.62: 1 -0.45,0; 2 0.45,0
CAPC1608X90N = smd 0.95 x 1: 1 -0.8,0; 2 0.8,0
AVX_W2L1 = smd 0.64 x 0.3: 1 -0.64,0.75; 2 -0.64,0.25; 3 -0.64,-0.25; 4 -0.64,-0.75; 5 0.64,-0.75; 6 0.64,-0.25; 7 0.64,0.25; 8 0.64,0.75
CAPC2012X135N = smd 1.05 x 1.4: 1 -0.9,0; 2 0.9,0
CAPMP7343X430N = smd 2.35 x 2.45: 1 -3.1,0; 2 3.1,0
INDC1608X95N = smd 0.95 x 1: 1 -0.8,0; 2 0.8,0
HIROSE_UX60_MB_5ST = smd 0.5 x 2: 1 -1.6,4.15; 2 -0.8,4.15; 3 0,4.15; 4 0.8,4.15; 5 1.6,4.15 | smd 2.5 x 2.2: SHIELD@1 -4.2,-1.4; SHIELD@2 -4.2,3.9; SHIELD@3 4.2,-1.4; SHIELD@4 4.2,3.9 | hole 0.9: -1.75,1.9; 1.75,1.9
HEADER254P1X2 = drill 1.168 round: 1 0,1.27; 2 0,-1.27
HEADER254P1X6 = drill 1.168 round: 1 0,6.31; 2 0,3.77; 3 0,1.23; 4 0,-1.31; 5 0,-3.85; 6 0,-6.39
142-0701-801 = smd 2.413 x 4.572: RING@1 -4.381,-2.794; RING@2 4.381,-2.794 | smd 2.413 x 4.572 bottom: RING@3 -4.381,-2.794; RING@4 4.381,-2.794 | smd 1.143 x 4.572: TIP 0,-2.794
CUI_PJ_102A = drill 1.887 round: 1 0,-3; 2 0,3; 3 -4.7,0
HEADER254P2X5 = drill 1.168 round: 1 -1.27,5.08; 2 1.27,5.08; 3 -1.27,2.54; 4 1.27,2.54; 5 -1.27,0; 6 1.27,0; 7 -1.27,-2.54; 8 1.27,-2.54; 9 -1.27,-5.08; 10 1.27,-5.08
HEADER254P1X3 = drill 1.168 round: 1 0,2.54; 2 0,0; 3 0,-2.54
RESC1005X40N = smd 0.6 x 0.6: 1 -0.45,0; 2 0.45,0
2501-2-00-80-00-00-07-0 = drill 2.39 round: 1 0,0
QFP50P2200X2200X160-144N = smd 1.5 x 0.3: 1 -10.7,8.75; 2 -10.7,8.25; 3 -10.7,7.75; 4 -10.7,7.25; 5 -10.7,6.75; 6 -10.7,6.25; 7 -10.7,5.75; 8 -10.7,5.25; 9 -10.7,4.75; 10 -10.7,4.25; 11 -10.7,3.75; 12 -10.7,3.25; 13 -10.7,2.75; 14 -10.7,2.25; 15 -10.7,1.75; 16 -10.7,1.25; 17 -10.7,0.75; 18 -10.7,0.25; 19 -10.7,-0.25; 20 -10.7,-0.75; 21 -10.7,-1.25; 22 -10.7,-1.75; 23 -10.7,-2.25; 24 -10.7,-2.75; 25 -10.7,-3.25; 26 -10.7,-3.75; 27 -10.7,-4.25; 28 -10.7,-4.75; 29 -10.7,-5.25; 30 -10.7,-5.75; 31 -10.7,-6.25; 32 -10.7,-6.75; 33 -10.7,-7.25; 34 -10.7,-7.75; 35 -10.7,-8.25; 36 -10.7,-8.75; 73 10.7,-8.75; 74 10.7,-8.25; 75 10.7,-7.75; 76 10.7,-7.25; 77 10.7,-6.75; 78 10.7,-6.25; 79 10.7,-5.75; 80 10.7,-5.25; 81 10.7,-4.75; 82 10.7,-4.25; 83 10.7,-3.75; 84 10.7,-3.25; 85 10.7,-2.75; 86 10.7,-2.25; 87 10.7,-1.75; 88 10.7,-1.25; 89 10.7,-0.75; 90 10.7,-0.25; 91 10.7,0.25; 92 10.7,0.75; 93 10.7,1.25; 94 10.7,1.75; 95 10.7,2.25; 96 10.7,2.75; 97 10.7,3.25; 98 10.7,3.75; 99 10.7,4.25; 100 10.7,4.75; 101 10.7,5.25; 102 10.7,5.75; 103 10.7,6.25; 104 10.7,6.75; 105 10.7,7.25; 106 10.7,7.75; 107 10.7,8.25; 108 10.7,8.75 | smd 0.3 x 1.5: 37 -8.75,-10.7; 38 -8.25,-10.7; 39 -7.75,-10.7; 40 -7.25,-10.7; 41 -6.75,-10.7; 42 -6.25,-10.7; 43 -5.75,-10.7; 44 -5.25,-10.7; 45 -4.75,-10.7; 46 -4.25,-10.7; 47 -3.75,-10.7; 48 -3.25,-10.7; 49 -2.75,-10.7; 50 -2.25,-10.7; 51 -1.75,-10.7; 52 -1.25,-10.7; 53 -0.75,-10.7; 54 -0.25,-10.7; 55 0.25,-10.7; 56 0.75,-10.7; 57 1.25,-10.7; 58 1.75,-10.7; 59 2.25,-10.7; 60 2.75,-10.7; 61 3.25,-10.7; 62 3.75,-10.7; 63 4.25,-10.7; 64 4.75,-10.7; 65 5.25,-10.7; 66 5.75,-10.7; 67 6.25,-10.7; 68 6.75,-10.7; 69 7.25,-10.7; 70 7.75,-10.7; 71 8.25,-10.7; 72 8.75,-10.7; 109 8.75,10.7; 110 8.25,10.7; 111 7.75,10.7; 112 7.25,10.7; 113 6.75,10.7; 114 6.25,10.7; 115 5.75,10.7; 116 5.25,10.7; 117 4.75,10.7; 118 4.25,10.7; 119 3.75,10.7; 120 3.25,10.7; 121 2.75,10.7; 122 2.25,10.7; 123 1.75,10.7; 124 1.25,10.7; 125 0.75,10.7; 126 0.25,10.7; 127 -0.25,10.7; 128 -0.75,10.7; 129 -1.25,10.7; 130 -1.75,10.7; 131 -2.25,10.7; 132 -2.75,10.7; 133 -3.25,10.7; 134 -3.75,10.7; 135 -4.25,10.7; 136 -4.75,10.7; 137 -5.25,10.7; 138 -5.75,10.7; 139 -6.25,10.7; 140 -6.75,10.7; 141 -7.25,10.7; 142 -7.75,10.7; 143 -8.25,10.7; 144 -8.75,10.7
QFN50P900X900X80-65AN = smd 0.85 x 0.3: 1 -4.45,3.75; 2 -4.45,3.25; 3 -4.45,2.75; 4 -4.45,2.25; 5 -4.45,1.75; 6 -4.45,1.25; 7 -4.45,0.75; 8 -4.45,0.25; 9 -4.45,-0.25; 10 -4.45,-0.75; 11 -4.45,-1.25; 12 -4.45,-1.75; 13 -4.45,-2.25; 14 -4.45,-2.75; 15 -4.45,-3.25; 16 -4.45,-3.75; 33 4.45,-3.75; 34 4.45,-3.25; 35 4.45,-2.75; 36 4.45,-2.25; 37 4.45,-1.75; 38 4.45,-1.25; 39 4.45,-0.75; 40 4.45,-0.25; 41 4.45,0.25; 42 4.45,0.75; 43 4.45,1.25; 44 4.45,1.75; 45 4.45,2.25; 46 4.45,2.75; 47 4.45,3.25; 48 4.45,3.75 | smd 0.3 x 0.85: 17 -3.75,-4.45; 18 -3.25,-4.45; 19 -2.75,-4.45; 20 -2.25,-4.45; 21 -1.75,-4.45; 22 -1.25,-4.45; 23 -0.75,-4.45; 24 -0.25,-4.45; 25 0.25,-4.45; 26 0.75,-4.45; 27 1.25,-4.45; 28 1.75,-4.45; 29 2.25,-4.45; 30 2.75,-4.45; 31 3.25,-4.45; 32 3.75,-4.45; 49 3.75,4.45; 50 3.25,4.45; 51 2.75,4.45; 52 2.25,4.45; 53 1.75,4.45; 54 1.25,4.45; 55 0.75,4.45; 56 0.25,4.45; 57 -0.25,4.45; 58 -0.75,4.45; 59 -1.25,4.45; 60 -1.75,4.45; 61 -2.25,4.45; 62 -2.75,4.45; 63 -3.25,4.45; 64 -3.75,4.45 | drill 0.33 round: PAD@1,1 -3,3; PAD@1,2 -3,1.8; PAD@1,3 -3,0.6; PAD@1,4 -3,-0.6; PAD@1,5 -3,-1.8; PAD@1,6 -3,-3; PAD@2,1 -1.8,3; PAD@2,2 -1.8,1.8; PAD@2,3 -1.8,0.6; PAD@2,4 -1.8,-0.6; PAD@2,5 -1.8,-1.8; PAD@2,6 -1.8,-3; PAD@3,1 -0.6,3; PAD@3,2 -0.6,1.8; PAD@3,3 -0.6,0.6; PAD@3,4 -0.6,-0.6; PAD@3,5 -0.6,-1.8; PAD@3,6 -0.6,-3; PAD@4,1 0.6,3; PAD@4,2 0.6,1.8; PAD@4,3 0.6,0.6; PAD@4,4 0.6,-0.6; PAD@4,5 0.6,-1.8; PAD@4,6 0.6,-3; PAD@5,1 1.8,3; PAD@5,2 1.8,1.8; PAD@5,3 1.8,0.6; PAD@5,4 1.8,-0.6; PAD@5,5 1.8,-1.8; PAD@5,6 1.8,-3; PAD@6,1 3,3; PAD@6,2 3,1.8; PAD@6,3 3,0.6; PAD@6,4 3,-0.6; PAD@6,5 3,-1.8; PAD@6,6 3,-3
QFP50P1200X1200X160-64N = smd 1.5 x 0.3: 1 -5.7,3.75; 2 -5.7,3.25; 3 -5.7,2.75; 4 -5.7,2.25; 5 -5.7,1.75; 6 -5.7,1.25; 7 -5.7,0.75; 8 -5.7,0.25; 9 -5.7,-0.25; 10 -5.7,-0.75; 11 -5.7,-1.25; 12 -5.7,-1.75; 13 -5.7,-2.25; 14 -5.7,-2.75; 15 -5.7,-3.25; 16 -5.7,-3.75; 33 5.7,-3.75; 34 5.7,-3.25; 35 5.7,-2.75; 36 5.7,-2.25; 37 5.7,-1.75; 38 5.7,-1.25; 39 5.7,-0.75; 40 5.7,-0.25; 41 5.7,0.25; 42 5.7,0.75; 43 5.7,1.25; 44 5.7,1.75; 45 5.7,2.25; 46 5.7,2.75; 47 5.7,3.25; 48 5.7,3.75 | smd 0.3 x 1.5: 17 -3.75,-5.7; 18 -3.25,-5.7; 19 -2.75,-5.7; 20 -2.25,-5.7; 21 -1.75,-5.7; 22 -1.25,-5.7; 23 -0.75,-5.7; 24 -0.25,-5.7; 25 0.25,-5.7; 26 0.75,-5.7; 27 1.25,-5.7; 28 1.75,-5.7; 29 2.25,-5.7; 30 2.75,-5.7; 31 3.25,-5.7; 32 3.75,-5.7; 49 3.75,5.7; 50 3.25,5.7; 51 2.75,5.7; 52 2.25,5.7; 53 1.75,5.7; 54 1.25,5.7; 55 0.75,5.7; 56 0.25,5.7; 57 -0.25,5.7; 58 -0.75,5.7; 59 -1.25,5.7; 60 -1.75,5.7; 61 -2.25,5.7; 62 -2.75,5.7; 63 -3.25,5.7; 64 -3.75,5.7
SOT95P280X110-5N = smd 1.1 x 0.6: 1 -1.35,0.95; 2 -1.35,0; 3 -1.35,-0.95; 4 1.35,-0.95; 5 1.35,0.95
SOIC127P600X175-8M = smd 1.75 x 0.65: 1 -2.8,1.905; 2 -2.8,0.635; 3 -2.8,-0.635; 4 -2.8,-1.905; 5 2.8,-1.905; 6 2.8,-0.635; 7 2.8,0.635; 8 2.8,1.905
FXO_HC73 = smd 1.8 x 2: 1 -2.54,-2.1; 2 2.54,-2.1; 3 2.54,2.1; 4 -2.54,2.1
OSCCC250X320X70-4N = smd 1.3 x 1.4: 1 -0.95,1.25; 2 -0.95,-1.25; 3 0.95,-1.25; 4 0.95,1.25

### Placement (x,y rotation side)
C1  72,39.5 270 top
C2  39.75,43.65 270 top
C3  33.4,33.5 0 top
C4  33.9,37.5 0 top
C5  33.9,26.5 0 top
C6  39,18.45 0 top
C7  54.25,17.95 90 top
C8  49.5,17.95 90 top
C9  60.05,23.75 180 top
C10  60.05,35.5 180 top
C11  60.05,32 180 top
C12  60.05,27 180 top
C13  42.45,18.8 0 top
C14  33.5,29.5 0 top
C15  44,44.65 270 top
C16  60.05,26.05 180 top
C17  44.45,18.35 90 top
C18  33.55,28.5 0 top
C19  45,44.05 270 top
C20  33.9,24.5 0 top
C21  59.75,37.75 180 top
C22  74.5,39.8 270 top
C23  70.75,41.6 0 top
C24  76,43.1 180 top
C25  80,26.7 90 top
C26  49.25,44.05 270 top
C27  54.25,43.65 270 top
C28  16.75,25 0 top
C29  14.5,25.5 0 top
C30  14.5,24.5 0 top
C31  17.5,29.4 90 top
C32  20.35,31.1 90 top
C33  14.5,29.5 0 top
C34  19.05,31.1 90 top
C35  19.05,18.9 90 top
C36  17.5,20.6 90 top
C37  14.5,20.5 180 top
C38  29.8,25.5 0 top
C39  19.25,33.5 0 top
C40  70.55,39.5 270 top
C41  23.85,9.35 270 top
C42  24.65,5.45 270 top
C43  9.65,5.45 270 top
C44  30.05,3.8 270 top
C45  15.05,3.8 270 top
C46  57,3.8 270 top
C47  10U  [CAPC1608X90N]  51.6,5.45 270 top
C48  65.75,3.8 270 top
C49  10U  [CAPC1608X90N]  60.35,5.45 270 top
C50  70,5.75 90 top
C51  70.5,23.75 90 top
C52  80.25,35.75 180 top
C53  63.6,34 0 top
C54  64.45,28.25 0 top
C55  73.5,23.75 90 top
C56  80.55,31.25 180 top
C57  80.55,28.75 180 top
C58  66,50.3 0 top
C59  12P  [CAPC1005X55N]  75.9,39.7 270 top
C60  12P  [CAPC1005X55N]  81.3,40.65 90 top
C61  80.7,48.45 90 top
FB1  33.7,21.2 180 top
FB2  60.29,39.04 180 top
FB3  70.75,43.1 180 top
FB4  76,44.6 0 top
J1  72.6,51.5 180 top
J2  39,48.5 180 top
J3  41,8.25 270 top
J4  18.25,38.75 180 top
J5  0,43 90 top
J6  0,19 90 top
J7  0,31 90 top
J8  0,7 90 top
J9  77.5,6.25 270 top
J10  72.75,18.75 90 top
J11  86.25,30.5 180 top
J12  66.1,23.5 270 top
J13  48.5,48.5 270 top
J14  60.25,48.5 180 top
R1  42.55,44.2 0 top
R2  42.55,45.15 0 top
R3  66,49.35 0 top
R4  74,42.2 270 top
R5  69.6,39.5 270 top
R6  87.05,37.8 0 top
R7  24R9  [RESC1005X40N]  15,31 270 top
R8  24R9  [RESC1005X40N]  14,31 270 top
R9  24R9  [RESC1005X40N]  15,19 90 top
R10  24R9  [RESC1005X40N]  14,19 90 top
R11  19.25,34.5 180 top
R12  2K2  [RESC1005X40N]  22.5,35.45 270 top
R13  87.05,38.7 180 top
R14  24R9  [RESC1005X40N]  64.45,27.3 180 top
R15  73.5,44.9 270 top
R16  72.5,44.9 270 top
R17  85.45,41.9 180 top
R18  80.3,44.4 180 top
R19  80.3,45.3 180 top
R20  85.45,41 180 top
R21  41.75,6.25 0 top
R22  58.25,46.75 270 top
R24  41.45,49.4 270 top
R25  56.75,46.75 270 top
R26  55.75,46.75 270 top
R38  74.95,12.6 180 top
TP1  10,28 0 top
TP2  10,22 0 top
U1  47,31 270 top
U2  23.25,25 0 top
U3  72.5,31.75 270 top
U4  27.25,4.5 90 top
U5  12.25,4.5 90 top
U6  54.2,4.5 90 top
U7  62.95,4.5 90 top
U8  84.2,46.6 90 top
X1  19.75,8 90 top
X2  12M  [OSCCC250X320X70-4N]  78.6,40.5 270 top

### Tracks (layer width: path | path; a pad name or v marks a point on that pad's centre or on a via)
+1V2D  (via drill 0.33)
  Top 0.3: U1.76 39.75,19.3 v39.45,19 | v34.45,33.5 34.7,33.75 U1.49 | v34.95,37.5 35.2,37.25 U1.42 | v54.25,19 U1.105 | U1.95 49.25,19.25 v49.5,19 | U1.63 35.2,26.75 v34.95,26.5 | U2.42 28.5,25.75 v28.75,25.5 | v34.6,29.5 35.35,28.75 U1.59 | U1.84 43.75,19.05 v43.5,18.8 | v59,27 58.75,26.75 U1.118 56.6,26.75 v56.4,26.95 | v44,43.6 44.25,43.35 U1.24 44.25,40.6 v44.05,40.4 | R2.2 R1.2 C15.2 | U1.33 C2.2
  Top 0.6: C6.2 v39.45,19 | C3.2 v34.45,33.5 | C4.2 v34.95,37.5 | C7.2 v54.25,19 | C8.2 v49.5,19 | C5.2 v34.95,26.5 | v28.75,25.5 C38.1 | R12.1 v22.5,36.5 | C14.2 v34.6,29.5 | C13.2 v43.5,18.8 | v59,27 C12.2 | v44,43.6 C15.2 | v40.35,43 39.95,43 C2.2 39.55,43 v39.15,43
  other vias: 51.7,8.25 52.95,8.25 52.95,7 51.7,7
  pour Route15 (isolate 0.2, rank 3, no thermals): 21.25,15.25 21.25,55 40.25,55 40.25,47.85 42.1,46.1 44.25,46.1 44.25,39.6 55.4,39.6 55.4,28 59.75,28 59.75,26.75 55.4,26.75 55.4,4 32.25,4 32.25,10 26.5,10
  pour Top (no thermals): 51.25,5.9 51.25,8.5 53.4,8.5 53.4,5.45 52.7,5.45 52.25,5.9
+1V8A  (via drill 0.33)
  Top 0.6: R11.2 v18.2,34.5
  other vias: 18.45,30.55 18.9,29.35 18.45,19.45 18.9,20.65 9.75,8.25 11,8.25 11,7 9.75,7
  pour Route15 (isolate 0.2, rank 3, no thermals): 0,0 0,49.5 20.55,49.5 20.5,15 26.25,9.25 31.5,9.25 31.5,0
  pour Top (no thermals): 18.25,21.25 19.5,21.25 19.5,20.25 19.25,20.25 19.25,19.2 18.25,19.2
  pour Top (no thermals): 18.25,30.8 19.25,30.8 19.25,29.75 19.5,29.75 19.5,28.75 18.25,28.75
  pour Top (no thermals): 9.3,5.9 9.3,8.5 11.45,8.5 11.45,5.45 10.75,5.45 10.3,5.9
+3V3A
  Top 0.3: 22.7,7.5 22.7,6.3 X1.1
  Top 0.6: X1.4 19.69,7.5 22.7,7.5 23.85,7.5 | 23.85,7.5 C41.2 | 23.85,7.5 24.65,6.7 C42.1 25.9,6.25 U4.5
+3V3D  (via drill 0.33)
  Top 0.3: C27.2 U1.4 54.25,40.8 v53.85,40.4 | C17.2 44.25,19 U1.85 44.25,21.35 v44,21.6 43.6,21.6 43.25,21.25 U1.83 | v64.65,34 U3.20 v68.1,34 | v73,27.35 73.25,27.1 U3.42 73.25,25 v73.5,24.75 | v79.5,31.25 79.25,31.5 U3.56 77.1,31.5 v76.9,31.7 | v79.5,28.75 79.25,28.5 U3.50 77.1,28.5 v76.9,28.3 | v65.5,28.25 65.75,28.5 U3.31 67.9,28.5 v68.1,28.7 | v59,23.75 U1.112 56.8,23.75 v56.4,24.15 | v56.4,26.05 56.6,26.25 U1.117 58.8,26.25 v59,26.05 | v56.4,36.15 56.8,35.75 U1.136 58.8,35.75 v59,35.55 | v49.15,43 49.25,42.9 U1.14 v49.25,40.4 | v44.95,43 44.75,42.8 U1.23 44.75,40.6 v44.95,40.4 | v37.6,28.25 U1.60 34.85,28.25 v34.6,28.5 | v56.4,31.75 U1.128 58.8,31.75 v59,31.95
  Top 0.6: v54.85,43 54.45,43 C27.2 54.05,43 v53.65,43 | C26.2 49.25,43.1 v49.15,43 | C19.2 45,43.05 v44.95,43 | R24.2 v41.45,48.35 | v58.25,45.7 R22.2 | v55.75,45.7 R26.2 | v56.75,45.7 R25.2 | v69.15,43.1 FB3.2 v69.95,43.9 | v77.6,44.6 FB4.2 v76.8,45.4 | R19.2 v79.85,45.9 | R18.2 v79.85,43.8 | C61.2 v81.3,48.9 82.3,48.9 U8.8 | v82.3,48.25 82.3,48.9 | v84.85,48.25 84.83,48.25 U8.6 | v85,40.4 R20.2 | R5.1 v69,39.95 | FB2.1 v61.84,39.04 v61.85,39.05 | C10.2 59.05,35.5 v59,35.55 | C11.2 59.05,32 v59,31.95 | v59,26.05 C16.2 | v59,23.75 C9.2 | v79.5,31.25 C56.2 | v79.5,28.75 C57.2 | C55.2 v73.5,24.75 | C54.2 v65.5,28.25 | v34.6,28.5 C18.2 | C53.2 v64.65,34 | v36,21.2 FB1.1
  Bottom 0.3: v44,21.6 45.2,20.4 45.2,10.36 J3.1
  Bottom 0.6: v44,21.6 44,22 44.6,22.6 | 44.6,22.6 55.4,22.6 v56.4,21.6 | v34.6,28.5 34.85,28.25 v37.6,28.25 38.6,27.25 38.6,23.8 | 38.6,23.8 v36,21.2 | 38.6,23.8 43.4,23.8 44.6,22.6
  other vias: 60.45,8.25 61.7,8.25 61.7,7 60.45,7 82.3,50.55 84.85,50.55
  pour Top (no thermals): 60,5.9 60,8.5 62.15,8.5 62.15,5.45 61.45,5.45 61,5.9
  pour Route15 (rank 2, no thermals): 44.75,40.2 44.75,46.5 42.5,46.5 40.85,48.15 40.85,55 90,55 90,0 56,0 56,26.25 60.25,26.25 60.25,28.5 56,28.5 56,40.2
+V  (via drill 0.33)
  Top 0.3: U5.3 13.2,3.35 | J9.1 R38.2
  other vias: 9.75,1.5 11.5,1.5 13.5,1.5 15.5,1.5 17.5,1.5 19.5,1.5 21.5,1.5 23.5,1.5 25.5,1.5 27.5,1.5 29.5,1.5 31.5,1.5 33.5,1.5 35.5,1.5 37.5,1.5 39.5,1.5 41.5,1.5 43.5,1.5 45.5,1.5 47.5,1.5 49.5,1.5 51.5,1.5 53.5,1.5 55.5,1.5 57.5,1.5 59.5,1.5 61.5,1.5 63.5,1.5 65.5,1.5 67.5,1.5 73.5,1.5 75.5,1.5 75.5,3.5 73.5,3.5
  pour Top (isolate 0.2, no thermals): 67.5,5.5 72.75,5.5 72.75,8 76.25,8 76.25,0 9,0 9,3.55 67.5,3.55
  pour Route15 (isolate 0.2, no thermals): 67.5,5.5 72.75,5.5 72.75,8 76.25,8 76.25,0 9,0 9,3.55 67.5,3.55
ADC_AIN1+
  Top 0.3: R7.2 15,29.55 C33.2 14.95,28.5 16.2,27.25 U2.4
ADC_AIN1-
  Top 0.3: R8.2 14,29.55 C33.1 14.05,28.5 15.8,26.75 U2.5
ADC_AIN2+
  Top 0.3: R10.2 14,20.45 C37.2 14.05,21.5 15.8,23.25 U2.12
ADC_AIN2-
  Top 0.3: R9.2 15,20.45 C37.1 14.95,21.5 16.2,22.75 U2.13
ADC_CLKOUTN
  Top 0.3: U2.39 31.5,24.25 32.5,25.25 U1.66
ADC_CLKOUTP
  Top 0.3: U2.40 31.25,24.75 32.25,25.75 U1.65
ADC_CS#
  Top 0.3: U2.20 21,17.25 26.5,11.75 47.25,11.75 51.75,16.25 U1.100
ADC_D1_0_1N
  Top 0.3: U2.43 29.25,26.25 30.25,27.25 U1.62
ADC_D1_0_1P
  Top 0.3: U2.44 29,26.75 30,27.75 U1.61
ADC_D1_2_3N
  Top 0.3: U1.57 35.4,29.75 34.9,30.25 31.75,30.25 28.75,27.25 U2.45
ADC_D1_2_3P
  Top 0.3: U1.55 31.5,30.75 28.5,27.75 U2.46
ADC_D1_4_5N
  Top 0.3: U2.47 28.25,28.25 31.25,31.25 U1.54
ADC_D1_4_5P
  Top 0.3: U2.48 28,28.75 31,31.75 U1.53
ADC_D1_6_7N
  Top 0.3: U2.49 27,30 29.25,32.25 U1.52
ADC_D1_6_7P
  Top 0.3: U2.50 26.5,30.25 29,32.75 34.75,32.75 35.25,33.25 U1.50
ADC_D1_8_9N
  Top 0.3: U2.51 26,30.5 29.75,34.25 U1.48
ADC_D1_8_9P
  Top 0.3: U2.52 25.5,30.75 29.5,34.75 U1.47
ADC_D1_10_11N
  Top 0.3: U2.53 25,31 29.25,35.25 U1.46
ADC_D1_10_11P
  Top 0.3: U2.54 24.5,31.25 29,35.75 U1.45
ADC_D1_12_13N
  Top 0.3: U2.55 24,31.5 28.75,36.25 U1.44
ADC_D1_12_13P
  Top 0.3: U2.56 23.5,31.75 28.5,36.75 U1.43
ADC_D1_14_15N
  Top 0.3: U2.57 23,32 29.25,38.25 U1.40
ADC_D1_14_15P
  Top 0.3: U2.58 22.5,32.25 29,38.75 U1.39
ADC_D2_0_1N
  Top 0.3: U2.23 22.5,18 27.25,13.25 46.5,13.25 48.75,15.5 U1.94
ADC_D2_0_1P
  Top 0.3: U2.24 23,18.25 27.5,13.75 46.25,13.75 48.25,15.75 U1.93
ADC_D2_2_3N
  Top 0.3: U2.25 23.5,18.5 27.75,14.25 46,14.25 47.75,16 U1.92
ADC_D2_2_3P
  Top 0.3: U2.26 24,18.75 28,14.75 45.75,14.75 47.25,16.25 U1.91
ADC_D2_4_5N
  Top 0.3: U2.27 24.5,19 28.25,15.25 45.5,15.25 46.75,16.5 U1.90
ADC_D2_4_5P
  Top 0.3: U2.28 25,19.25 28.5,15.75 45.25,15.75 46.25,16.75 U1.89
ADC_D2_6_7N
  Top 0.3: U2.29 25.5,19.5 28.75,16.25 45,16.25 45.75,17 U1.88
ADC_D2_6_7P
  Top 0.3: U2.30 26,19.75 29,16.75 44.75,16.75 45.25,17.25 U1.87
ADC_D2_8_9N
  Top 0.3: U2.31 26.5,20 29.25,17.25 40.15,17.25 40.75,17.85 U1.78
ADC_D2_8_9P
  Top 0.3: U2.32 27,20.25 29.5,17.75 39.9,17.75 40.25,18.1 U1.77
ADC_D2_10_11N
  Top 0.3: U2.33 28,21.25 30.05,19.2 38.55,19.2 38.75,19.4 U1.74
ADC_D2_10_11P
  Top 0.3: U2.34 28.25,21.75 30.3,19.7 38.25,19.7 U1.73
ADC_D2_12_13N
  Top 0.3: U2.35 U1.72
ADC_D2_12_13P
  Top 0.3: U2.36 U1.71
ADC_D2_14_15N
  Top 0.3: U2.37 U1.70
ADC_D2_14_15P
  Top 0.3: U2.38 U1.69
ADC_ENCP
  Top 0.3: U2.18 20,16.75 18.5,15.25 18.5,11.5 17.65,10.65 X1.3
ADC_OF2_1N
  Top 0.3: U2.59 22,32.5 28.75,39.25 U1.38
ADC_OF2_1P
  Top 0.3: U2.60 21.5,32.75 28.5,39.75 U1.37
ADC_SCK
  Top 0.3: U2.21 21.5,17.5 26.75,12.25 47,12.25 51.25,16.5 U1.99
ADC_SDI
  Top 0.3: U2.22 22,17.75 27,12.75 46.75,12.75 50.75,16.75 U1.98
ADC_SDO
  Top 0.2: U2.61 21,33 22.5,34.5 R12.2
  Top 0.3: R12.2 23,35 28.25,40.25 37.8,40.25 38.25,40.7 U1.36
ADC_SENSE
  Top 0.2: 20,29.95 19.7,30.25 C39.2
  Top 0.3: U2.63 20,29.95 | C39.2 R11.1 19.7,36.03 J4.1
ADC_VCM1  (via drill 0.33)
  Top 0.3: U2.2 18.2,28.25 C31.1 v16.25,28.95
  Bottom 0.3: v16.25,28.95 15.55,28.25 10.25,28.25 TP1.1
ADC_VCM2  (via drill 0.33)
  Top 0.3: U2.15 18.2,21.75 C36.2 v16.25,21.05
  Bottom 0.3: v16.25,21.05 16.2,21.05 15.5,21.75 10.25,21.75 TP2.1
AIN1+
  Top 0.3: J5.TIP 6.25,43 arc-90 7.25,42 7.25,38.5 arc90 8.25,37.5 13.5,37.5 arc-90 15,36 R7.1
AIN1-
  Top 0.3: J7.TIP 6.25,31 arc90 7.25,32 7.25,35.5 arc-90 8.25,36.5 13.25,36.5 arc-90 14,35.75 arc-90 13.25,35 arc90 12.5,34.25 arc90 13.25,33.5 arc-90 14,32.75 R8.1
AIN2+
  Top 0.3: J6.TIP 6.25,19 arc-90 7.25,18 7.25,14.5 arc90 8.25,13.5 13.25,13.5 arc90 14,14.25 arc90 13.25,15 arc-90 12.5,15.75 arc-90 13.25,16.5 arc90 14,17.25 R10.1
AIN2-
  Top 0.3: J8.TIP 6.25,7 arc90 7.25,8 7.25,11.5 arc-90 8.25,12.5 13.5,12.5 arc90 15,14 R9.1
FPGA_CCLK
  Top 0.3: U1.16 48.25,45.5 48.5,45.75 J13.6
FPGA_CFG1  (via drill 0.33)
  Top 0.3: U1.9 51.75,42.8 v51.5,43.05 | J14.1 58.28,47.23 R22.1
  Bottom 0.3: v51.5,43.05 55.7,47.25 60.23,47.25 J14.1
FPGA_CSSPIN
  Top 0.3: U1.13 49.75,42.6 50,42.85 50,45.6 49.75,45.85 49.75,48.52 J13.5
FPGA_CSSPISN
  Top 0.3: U1.11 50.75,45.5 51.04,45.79 J13.4
FPGA_DONE
  Top 0.3: R25.1 56.75,47.85 56.1,48.5 52.31,48.5 | 52.31,48.5 J13.3 | U1.8 52.25,46.7 52.3,46.75 52.3,48.49 52.31,48.5
FPGA_INITN
  Top 0.3: U1.20 46.25,45 44.7,46.55 44.7,48.49 J13.9 41.53,49.77 R24.1
FPGA_PROGRAMN
  Top 0.3: U1.7 52.75,46.4 J13.2 55.72,47.23 R26.1
FPGA_SI
  Top 0.3: U1.19 46.75,46.44 J13.8
FPGA_SO
  Top 0.3: U1.18 47.25,48.48 J13.7
FPGA_TCK  (via drill 0.33)
  Top 0.3: U1.81 42.25,22.5 v42.5,22.75 | R21.2 42.2,8.22 J3.3
  Bottom 0.3: v42.5,22.75 42.25,22.5 42.25,19.5 41.25,18.5 41.25,9.23 J3.3
FPGA_TDI  (via drill 0.33)
  Top 0.3: U1.80 41.75,22.5 v41.5,22.75
  Bottom 0.3: v41.5,22.75 41.75,22.5 41.75,19.75 40.75,18.75 40.75,9.31 J3.4
FPGA_TDO  (via drill 0.33)
  Top 0.3: U1.82 42.75,21.75 v43,22
  Bottom 0.3: v43,22 43,19.3 42.75,19.05 42.75,10.27 J3.2
FPGA_TMS  (via drill 0.33)
  Top 0.3: U1.79 41.25,21.75 v41,22
  Bottom 0.3: v41,22 41,19.75 40.25,19 40.25,11.35 J3.5
FTDI_A_CLKOUT
  Top 0.3: U3.32 66.25,28 65.7,27.45 64.9,27.45 R14.1
FTDI_VCORE
  Top 0.3: U3.12 70.75,38.85 C40.2 | C51.2 70.75,24.45 U3.37 | U3.64 79.55,35.5 C52.2
  pour Top (isolate 0.2, no thermals): 70.75,26.75 70.75,37.25 78.15,37.25 78.15,28 80.55,28 80.55,26.75
GND  (via drill 0.33)
  Top 0.3: v54.75,40.25 U1.3 | v50.25,40.3 U1.12 | U1.41 v37.75,37.75 | U1.51 v37.75,32.75 | U1.64 v37.75,26.25 | U1.68 v37.75,24.25 | U1.75 v39.25,21.75 | U1.97 v50.25,21.75 | U1.106 v54.75,21.75 | U1.111 v56.25,23.25 | U1.126 v56.25,30.75 | U1.135 v56.25,35.25 | U1.139 v56.25,37.25 | U2.19 20.5,16 v20.25,15.75 | U3.11 71.25,36.4 v71.5,36.15 71.75,36.4 U3.10 | U3.5 v74.25,36.15 | U3.1 v76.25,36.15 | U3.47 75.75,27.15 v75.55,27.35 | U3.51 77.1,29 v76.9,29.2 | U3.15 v69.25,36.15 | U3.13 70.25,36.35 v70.05,36.15 | C24.1 v77.55,43.1 | U3.35 v69.75,27.35 | U3.25 v68.1,31.5
  Top 0.5: J1.5 v71,45.8
  Top 0.6: C39.1 v18.2,33.5 | C32.2 v20.35,32.3 | U6.2 v54.2,4.5 | U7.2 v62.95,4.5 | U5.2 v12.25,4.5 | U4.2 v27.25,4.5 | C23.1 v69.2,41.6 | R4.1 v74,43.25 | C60.1 v81.3,39.6 | C61.1 v81.3,48 | C2.1 v39.75,44.7 | C15.1 v44,45.7 | C19.1 v45,45.1 | C26.1 v49.25,45.1 | C27.1 v54.25,44.7 | C17.1 v43.85,17.9 | C8.1 v49.5,16.9 | C7.1 v54.25,16.9 | C9.1 v61.1,23.75 | C16.1 v61.1,26.05 | C12.1 v61.1,27 | C11.1 v61.1,32 | v63.4,28.25 C54.1 | C10.1 v61.1,35.5 | C21.1 v60.8,37.75 | v73.5,22.7 C55.1 | C57.1 v81.6,28.75 | C56.1 v81.6,31.25 | C52.1 v81.3,35.75 | C40.1 v70.55,40.55 | C1.1 v72,40.55
  other vias: 13.25,25.5 13.25,24.5 15,23.5 15,26.5 19,32.3 18.45,31.65 30.85,25.5 39.15,40.4 44.95,21.75 37.95,18.45 32.85,24.5 32.5,29.5 32.5,28.5 32.85,26.5 32.85,37.5 32.35,33.5 17.4,22 16.9,20.15 17.4,28 16.9,29.85 18.45,18.35 1,4.5 2.5,4.5 4,4.5 5.5,4.5 5.75,2.75 1,9.5 2.5,9.5 4,9.5 5.5,9.5 5.75,11.25 5.5,16.5 5.75,14.75 1,16.5 2.5,16.5 4,16.5 1,21.5 2.5,21.5 4,21.5 5.5,21.5 5.75,23.25 5.75,26.75 5.5,28.5 1,28.5 2.5,28.5 4,28.5 1,33.5 2.5,33.5 4,33.5 5.5,33.5 5.75,35.25 5.75,38.75 5.5,40.5 1,40.5 2.5,40.5 4,40.5 1,45.5 2.5,45.5 4,45.5 5.5,45.5 5.75,47.25 19,17.7 8.5,35.25 11.5,35.25 8.5,33.75 8.5,32.25 11.5,33.5 12.75,32.25 12.5,30.75 8.5,38.75 10,38.75 11.5,38.75 13,38.75 14.5,38.5 16,37 16.25,35.5 16.25,34 16.25,32.5 16.5,31 16,30 8.5,40.25 8.5,41.75 8.25,43.25 7.25,44.25 7.25,45.75 7.25,47.25 7.25,48.75 8.25,30.75 7.25,29.75 7.25,28.25 7.25,26.75 7.25,20.25 7.25,21.75 7.25,23.25 7.25,25 8.25,19.25 8.5,14.75 8.5,16.25 8.5,17.75 11.5,14.75 11.5,16.5 12.75,17.75 12.5,19.25 13.75,27.55 13.75,22.45 13,20.95 13,29.05 8.75,25 10.25,25 11.75,25 8.75,49 10.25,49 11.75,49 13.25,49 14.75,49 16.25,49 17.75,49 20.25,46.25 20.25,44.75 20.25,43.25 20.25,41.75 20.25,40.25 20.25,37.25 8.5,11.25 10,11.25 11.5,11.25 13,11.25 14.5,11.5 16,13 16.25,14.5 16.25,16 16.25,17.5 16.5,19 8.5,9.75 8.5,8.25 8.25,6.75 7.25,5.75 7.25,4.25 7.25,2.75 7.25,1.25 26.25,9 25,10 24,11 23,12 22,13 21,14 20.25,38.75 10,14.75 10,35.25 25.75,4.5 28.75,4.5 27.25,6 13.75,4.5 10.75,4.5 55.7,4.5 52.7,4.5 62.95,6 61.45,4.5 68.2,8.85 68.25,10.5 70,10.6 71.75,10.5 71.8,8.85 77.5,3.25 77.5,5.25 77.5,7.25 78.5,8.25 79.5,9.25 81.5,9.25 82.5,8.25 82.5,4.25 81.5,3.25 79.5,3.25 78.5,4.25 78.5,2.25 80.5,2.25 80.5,10.25 82.5,2.25 82.5,6.25 80.5,8.25 80.5,4.25 78.5,6.25 82.5,10.25 42,18.2 21.5,15.5 22.5,14.5 23.5,13.5 24.5,12.5 25.5,11.5 26.5,10.5 64.95,7.5 63.45,7.5 64.95,6 23.5,4.5 23.5,6 14.25,6 12.25,6 29.25,6 68.25,7 70,7 71.75,7 66.45,6 66.45,7.5 64.45,4.5 54.2,6 54.7,7.5 56.2,7.5 57.7,7.5 56.2,6 57.7,6 30.75,6 30.75,7.5 29.25,7.5 27.75,7.5 59.2,4.5 59.2,6 15.75,6 15.75,7.5 14.25,7.5 12.75,7.5 8.5,4.5 83.5,9.25 83.5,7.25 83.5,5.25 83.5,3.25 84.5,4.25 84.5,2.25 84.5,6.25 84.5,8.25 84.5,10.25 28,10.5 29.5,10.5 31,10.5 32.5,10.5 32.75,9 32.75,7.5 27.75,9 29.25,9 30.75,9 18.5,16.5 19.5,14.5 19.5,13 19.5,11.5 17.5,15.5 17.5,14 17.5,12.5 19.5,10 18.75,9 17.25,9 15.75,9 15.75,10.5 17.25,7.5 20.75,12.25 20.75,9 22.25,9 19.75,6 19.75,4.5 26.25,7.5 25,8.25 19.25,49 20.25,47.75 62.55,34.05 70.45,22.8 80.8,25.9 80,25.15 74.45,40.85 40.7,6.25 64.65,50.3 64.65,49.35 75.95,40.75 83.55,47.95 86.1,47.95 86,37.8 83.55,50.85 86.1,50.85 21.55,34.7 21.55,36.2 21.55,37.7 21.55,39.2 21.55,40.7 21.55,42.2 21.55,43.7 21.55,45.2 21.55,46.7 21.55,48.2 21.55,49.7 29.6,37.5 31.35,37.5 30.1,33.5 31,28.5 30.6,26.5 29.6,21.5 31.1,21.5 30.6,20.5 37.45,20.5 27.75,20.5 29.75,18.5 28.75,19.5 31.5,18.5 33.25,18.5 35,18.5 36.5,18.5 32.75,6 32.75,4.5 34.25,4.5 35.75,4.5 37.25,4.5 38.75,4.5 40.25,4.5 41.75,4.5 43.25,4.5 44.75,4.5 46.25,4.5 47.75,4.5 49.25,4.5 33.75,11 35.25,11 36.75,11 38.25,11 42,11 44,11 46,11 47.5,11 48.75,12 50,13.25 51.25,14.5 52.5,15.75 52.5,17.25 52.5,18.75 55.25,18.75 56.75,19.25 46.75,21.75 48.5,21.75 51.75,21.75 53.25,21.75 50.45,4.5 50.45,6 21.55,51.2 21.55,52.7 22.55,53.95 24.05,53.95 25.55,53.95 27.05,53.95 28.55,53.95 30.05,53.95 31.55,53.95 33.05,53.95 34.55,53.95 36.05,53.95 37.55,53.95 39.05,53.95 40.55,53.95 23.55,36.7 24.55,37.7 25.55,38.7 26.55,39.7 27.55,40.7 29,41.05 30.5,41.05 32,41.05 33.5,41.05 35,41.05 37.5,41 37.5,42.25 38.25,43.5 38.5,45.75 37.5,47.25 42.05,53.95 43.55,53.95 45.05,53.95 46.55,53.95 48.05,53.95 49.55,53.95 51.05,53.95 52.55,53.95 54.05,53.95 55.55,53.95 57.05,53.95 58.55,53.95 60.05,53.95 61.55,53.95 63.05,53.95 64.55,53.95 66.05,53.95 66.3,52.45 65.5,37.5 68,37.5 68,39 63.75,37.75 63.25,39.25 62,40.5 60.25,41 58.5,41 56.75,41 56.75,42.75 79.05,53.95 80.55,53.95 82.05,53.95 83.55,53.95 85.05,53.95 86.55,53.95 88.05,53.95 89,52.75 89,51.25 89,49.75 89,48.25 89,46.75 89,45.25 89,43.75 89,42.25 89,40.75 89,39.25 89,37.75 89,36.25 89,34.75 89,33.25 89,31.75 89,30.25 89,28.75 89,27.25 89,25.75 89,24.25 89,22.75 89,21.25 89,19.75 89,18.25 89,16.75 89,15.25 89,13.75 89,12.25 89,10.75 89,9.25 89,7.75 89,6.25 89,4.75 89,3.25 89,1.75 87.5,1 86,1 84.5,1 83,1 81.5,1 80,1 78.5,1 77,1 24,51.5 28,51.5 32,51.5 36,51.5 34,49.5 30,49.5 26,49.5 24,47.5 28,47.5 32,47.5 36,47.5 34,45.5 30,45.5 26,45.5 24,43.5 28,43.5 32,43.5 36,43.5 26,41.5 24,39.5 41,37.5 43,35.5 45,37.5 47,35.5 49,37.5 51,35.5 53,37.5 41,33.5 45,33.5 49,33.5 53,33.5 51,31.5 47,31.5 43,31.5 41,29.5 45,29.5 49,29.5 53,29.5 51,27.5 47,27.5 43,27.5 41,25.5 45,25.5 49,25.5 53,25.5 51,23.5 47,23.5 55,31.5 55,35.5 51,39.5 47,39.5 43,39.5 39,35.5 39,31.5 55,9 55,10.75 55,12.5 55,14.25 55,16 56.5,9 56.5,10.75 56.5,12.5 56.5,14.25 56.5,16 56.5,17.75
  pour Top (isolate 0.2, no thermals): 12.95,25.8 13.6,25.8 13.75,25.65 14.2,25.65 14.2,24.35 13.75,24.35 13.6,24.2 12.95,24.2
  pour Route2 (isolate 0.2, no thermals): 0,0 0,55 90,55 90,0
  pour Top (isolate 0.2, rank 3): 21.25,55 21.25,15.25 26.5,10 32.25,10 32.25,0 90,0 90,55
  pour Top (isolate 0.2, rank 2): 7,49.5 20.55,49.5 20.55,31.4 20.15,31.4 20.15,33.15 17.75,33.15 17.75,29.75 21.5,29.75 21.5,25 19.75,25 19.75,26.25 12.5,26.25 12.5,25 7,25
  pour Top (no thermals): 0,30 6.25,30 6.25,25.5 0,25.5
  pour Top (no thermals): 0,42 6.25,42 6.25,37.5 0,37.5
  pour Top (no thermals): 0,18 6.25,18 6.25,13.5 0,13.5
  pour Top (no thermals): 0,6 6.25,6 6.25,1.5 0,1.5
  pour Top (no thermals): 0,48.5 6.25,48.5 6.25,44 0,44
  pour Top (no thermals): 0,36.5 6.25,36.5 6.25,32 0,32
  pour Top (no thermals): 0,24.5 6.25,24.5 6.25,20 0,20
  pour Top (no thermals): 0,12.5 6.25,12.5 6.25,8 0,8
  pour Top (isolate 0.2, rank 2, no thermals): 7,25 12.5,25 12.5,23.75 19.75,23.75 19.75,25 21.5,25 21.5,20.25 17.75,20.25 17.75,16.85 20.55,16.85 20.55,14.95 26.25,9.25 31.5,9.25 31.5,0 7,0
  pour Top (no thermals): 18.25,31.4 18.25,32.6 19.25,32.6 19.25,31.4
  pour Top (no thermals): 18.25,17.4 18.25,18.6 19.25,18.6 19.25,17.4
  pour Bottom (isolate 0.2, rank 2, no thermals): 0,49.5 20.55,49.5 20.5,15 26.25,9.25 31.5,9.25 31.5,0 0,0
  pour Bottom (isolate 0.2, rank 2): 21.25,55 90,55 90,0 32.25,0 32.25,10 26.5,10 21.25,15.25
N$1
  Top 0.3: U1.26 43.25,42.6 42.85,43 42,43 41.25,43.75 41.25,45.05 | 41.25,45.05 42,45.05 R2.1 | J2.1 39.07,47.23 41.25,45.05
N$2
  Top 0.2: C28.2 16.45,25.25 16.76,24.94 16.76,24.75 | C28.6 16.76,24.75 | 16.76,24.75 16.76,24.56 16.45,24.25 C28.4 15.5,24.25
  Top 0.3: C28.6 U2.9
  pour Top (no thermals): 14.75,24.7 15.2,24.7 15.65,24.25 15.3,24.25 15.25,24.3 14.75,24.3
N$3
  Top 0.3: J9.3 77.05,10.95 R38.1
N$4
  Top 0.3: U2.62 20.5,30.5 C32.1
N$5
  Top 0.3: U3.38 71.25,22.55 70.75,22.05 68.55,22.05 67.75,21.25 67.75,20.1 J10.2
N$6
  Top 0.3: U1.138 65.2,36.75 65.95,36 67.75,36 68.75,37 U3.16
N$7
  Top 0.3: U3.17 65.7,35.5 64.95,36.25 U1.137
N$8
  Top 0.3: U3.18 65.45,35 65.2,35.25 61.9,35.25 61.4,34.75 U1.134
N$9
  Top 0.3: U3.19 65.2,34.5 64.95,34.75 62.15,34.75 61.65,34.25 U1.133
N$10
  Top 0.3: U3.21 65.15,33.5 64.9,33.25 62.35,33.25 61.85,33.75 U1.132
N$11
  Top 0.3: U1.25 43.75,42.85 43.1,43.5 42.6,43.5 42.1,44 R1.1
N$12  (via drill 0.33)
  Top 0.3: U1.67 35.2,24.75 v34.95,24.5
  Top 0.6: v34.95,24.5 C20.2 | FB1.2 v32.15,21.2
  Bottom 0.6: v32.15,21.2 32.15,21.7 v34.95,24.5
N$13
  Top 0.3: U1.140 C21.2
  Top 0.6: C21.2 59.3,38.85 FB2.2
N$14
  Top 0.3: U3.22 65.4,33 65.15,32.75 62.1,32.75 61.6,33.25 U1.131
N$15
  Top 0.3: U3.23 65.65,32.5 65.4,32.25 61.85,32.25 61.35,32.75 U1.130
N$16
  Top 0.3: U3.24 65.9,32 65.65,31.75 61.9,31.75 61.4,31.25 U1.127
N$17
  Top 0.3: U3.26 61.9,31 61.15,30.25 U1.125
N$18
  Top 0.3: U3.27 62.15,30.5 61.4,29.75 U1.124
N$19
  Top 0.3: U3.28 62.4,30 61.65,29.25 U1.123
N$20
  Top 0.3: U3.29 62.65,29.5 61.9,28.75 U1.122
N$21
  Top 0.3: C28.8 U2.7
N$22
  Top 0.2: C28.7 17.05,25.25 16.55,25.75 C28.1 15.77,25.75 15.46,25.44 | C28.3 15.77,24.75 15.46,25.06 15.46,25.44 | C29.2 15.4,25.5 15.46,25.44
  Top 0.3: C28.7 U2.8
  pour Top (no thermals): 14.75,25.7 15.7,25.7 15.45,25.45 15.45,25.3 14.75,25.3
N$23
  Top 0.3: U3.30 62.9,29 62.15,28.25 U1.121
N$24
  Top 0.3: C28.5 U2.10
N$25
  Top 0.3: U1.120 61.5,27.75 62.6,26.65 68.75,26.65 U3.33
N$26
  Top 0.3: U3.7 73.25,44.2 R15.2
N$27  (via drill 0.33)
  Top 0.3: U3.4 74.75,38.5 v74.5,38.75 | C24.2 75.15,43.05 | C24.2 FB4.1 | C24.2 75.2,39.8 74.9,39.5 74.65,39.5 C22.2
  Top 0.6: v74.5,38.75 C22.2
N$28
  Top 0.3: U3.9 72.25,38.45 72,38.7 C1.2 71.85,39.2 71.45,39.2 71.3,39.35 71.3,41.4 71.5,41.6 C23.2 FB3.1
N$29
  Top 0.3: R16.1 72.75,45.6 72.75,47.2 J1.3
N$30  (via drill 0.33)
  Top 0.3: v76.8,49.35 J1.SHIELD@2
  Top 0.6: J1.SHIELD@4 v68.4,49.35 | v68.4,49.35 J1.SHIELD@3 | v68.4,49.35 R3.2 C58.2 | J1.SHIELD@2 J1.SHIELD@1
  Bottom 0.6: v68.4,49.35 70,50.95 75.2,50.95 v76.8,49.35
N$31
  Top 0.3: U3.3 75.25,38.6 C59.2 77.05,39.25 X2.3
N$32
  Top 0.3: U3.2 75.75,38.35 75.95,38.55 78.2,38.55 78.6,38.95 78.6,40.25 79.8,41.45 X2.1 80.2,41.1 C60.2
N$33
  Top 0.3: U3.6 73.75,41.5 R4.2
N$34
  Top 0.3: U3.14 69.75,38.9 R5.2
N$35
  Top 0.3: U3.39 71.75,22.3 70.95,21.5 69.75,21.5 68.95,20.7 68.95,18.74 J10.3
N$36  (via drill 0.33)
  Top 0.3: U1.144 58.25,39.75 58.65,40.15 v59.5,40.15 | v62.6,27.7 62.85,27.45 63.85,27.45 R14.2
  Bottom 0.3: v62.6,27.7 61.85,28.45 61.85,37.8 v59.5,40.15
N$37
  Top 0.3: R15.1 73.25,45.6 73.25,47.2 J1.2
N$38
  Top 0.3: U3.8 72.75,44.2 R16.2
N$39
  Top 0.3: U3.63 81.75,35 82.45,35.7 82.45,43.65 U8.1 82.3,44.4 R18.1
N$40
  Top 0.3: U3.62 82,34.5 82.95,35.45 82.95,41.95 83.4,42.4 83.4,43.63 U8.2 83.56,44.23 82.5,45.3 R19.1
N$41
  Top 0.3: U3.61 82.25,34 83.45,35.2 83.45,40.8 84.4,41.75 84.85,41.75 R17.2 85,43.63 U8.3
N$42
  Top 0.3: U8.4 85.9,43.59 R17.1 R20.1
N$43
  Top 0.3: U3.40 72.25,22.06 J10.4
N$44
  Top 0.3: U3.41 72.75,21.8 71.5,20.55 71.5,18.73 J10.5
N$45  (via drill 0.33)
  Top 0.3: U3.43 73.75,27.1 v74,27.35
  Bottom 0.3: J10.6 72.75,26.1 v74,27.35
N$46
  Top 0.3: U3.44 74.25,20.75 74,20.5 74,18.77 J10.7
N$47
  Top 0.3: U3.45 74.75,21.75 75.25,21.25 75.25,20.06 J10.8
N$48
  Top 0.3: U3.46 75.25,22 76.55,20.7 76.55,18.76 J10.9
N$49
  Top 0.3: U3.48 76.25,25 77,24.25 83.81,24.25 J11.2
N$50
  Top 0.3: U3.52 82,29.5 83.5,28 83.5,27.5 84.3,26.7 86.26,26.7 J11.3
N$51
  Top 0.3: U3.53 82.69,30 84.73,27.96 J11.4
N$52
  Top 0.3: U3.54 83,30.5 84.25,29.25 86.27,29.25 J11.5
N$53  (via drill 0.33)
  Top 0.3: U3.55 77.1,31 v76.9,30.8
  Bottom 0.3: v76.9,30.8 77.2,30.5 J11.6
N$54
  Top 0.3: J11.7 86.23,31.75 84.5,31.75 84.25,32 U3.57
N$55
  Top 0.3: U3.58 83.27,32.5 83.81,33.04 J11.8
N$58  (via drill 0.33)
  Top 0.3: v76.9,33.5 U3.60
  Bottom 0.3: v76.9,33.5 74.1,33.5 68.8,28.2 68.8,23.66 J12.1
N$59
  Top 0.3: U3.36 70.25,25.15 69.85,24.75 67.35,24.75 J12.2
PWRSAV#
  Top 0.3: U3.59 83,33 84.3,34.3 86.24,34.3 J11.9 87.52,37.78 R6.2 R13.1
VBUS  (via drill 0.33)
  Top 0.3: J1.1 74.2,46.6
  Top 0.5: 74.2,46.6 v74.85,45.95
  Top 0.6: v86,38.7 R13.2
  Bottom 0.3: v86,38.7 86,41 80.4,46.6 75.5,46.6 v74.85,45.95

### Text on the board
tPlace: SHAREBRAINED TECHNOLOGY | ADC-IQ-2185-XP2 | 20111106